# EAGLE board cape-c (EAGLE 6.6.0), part 1 of 2
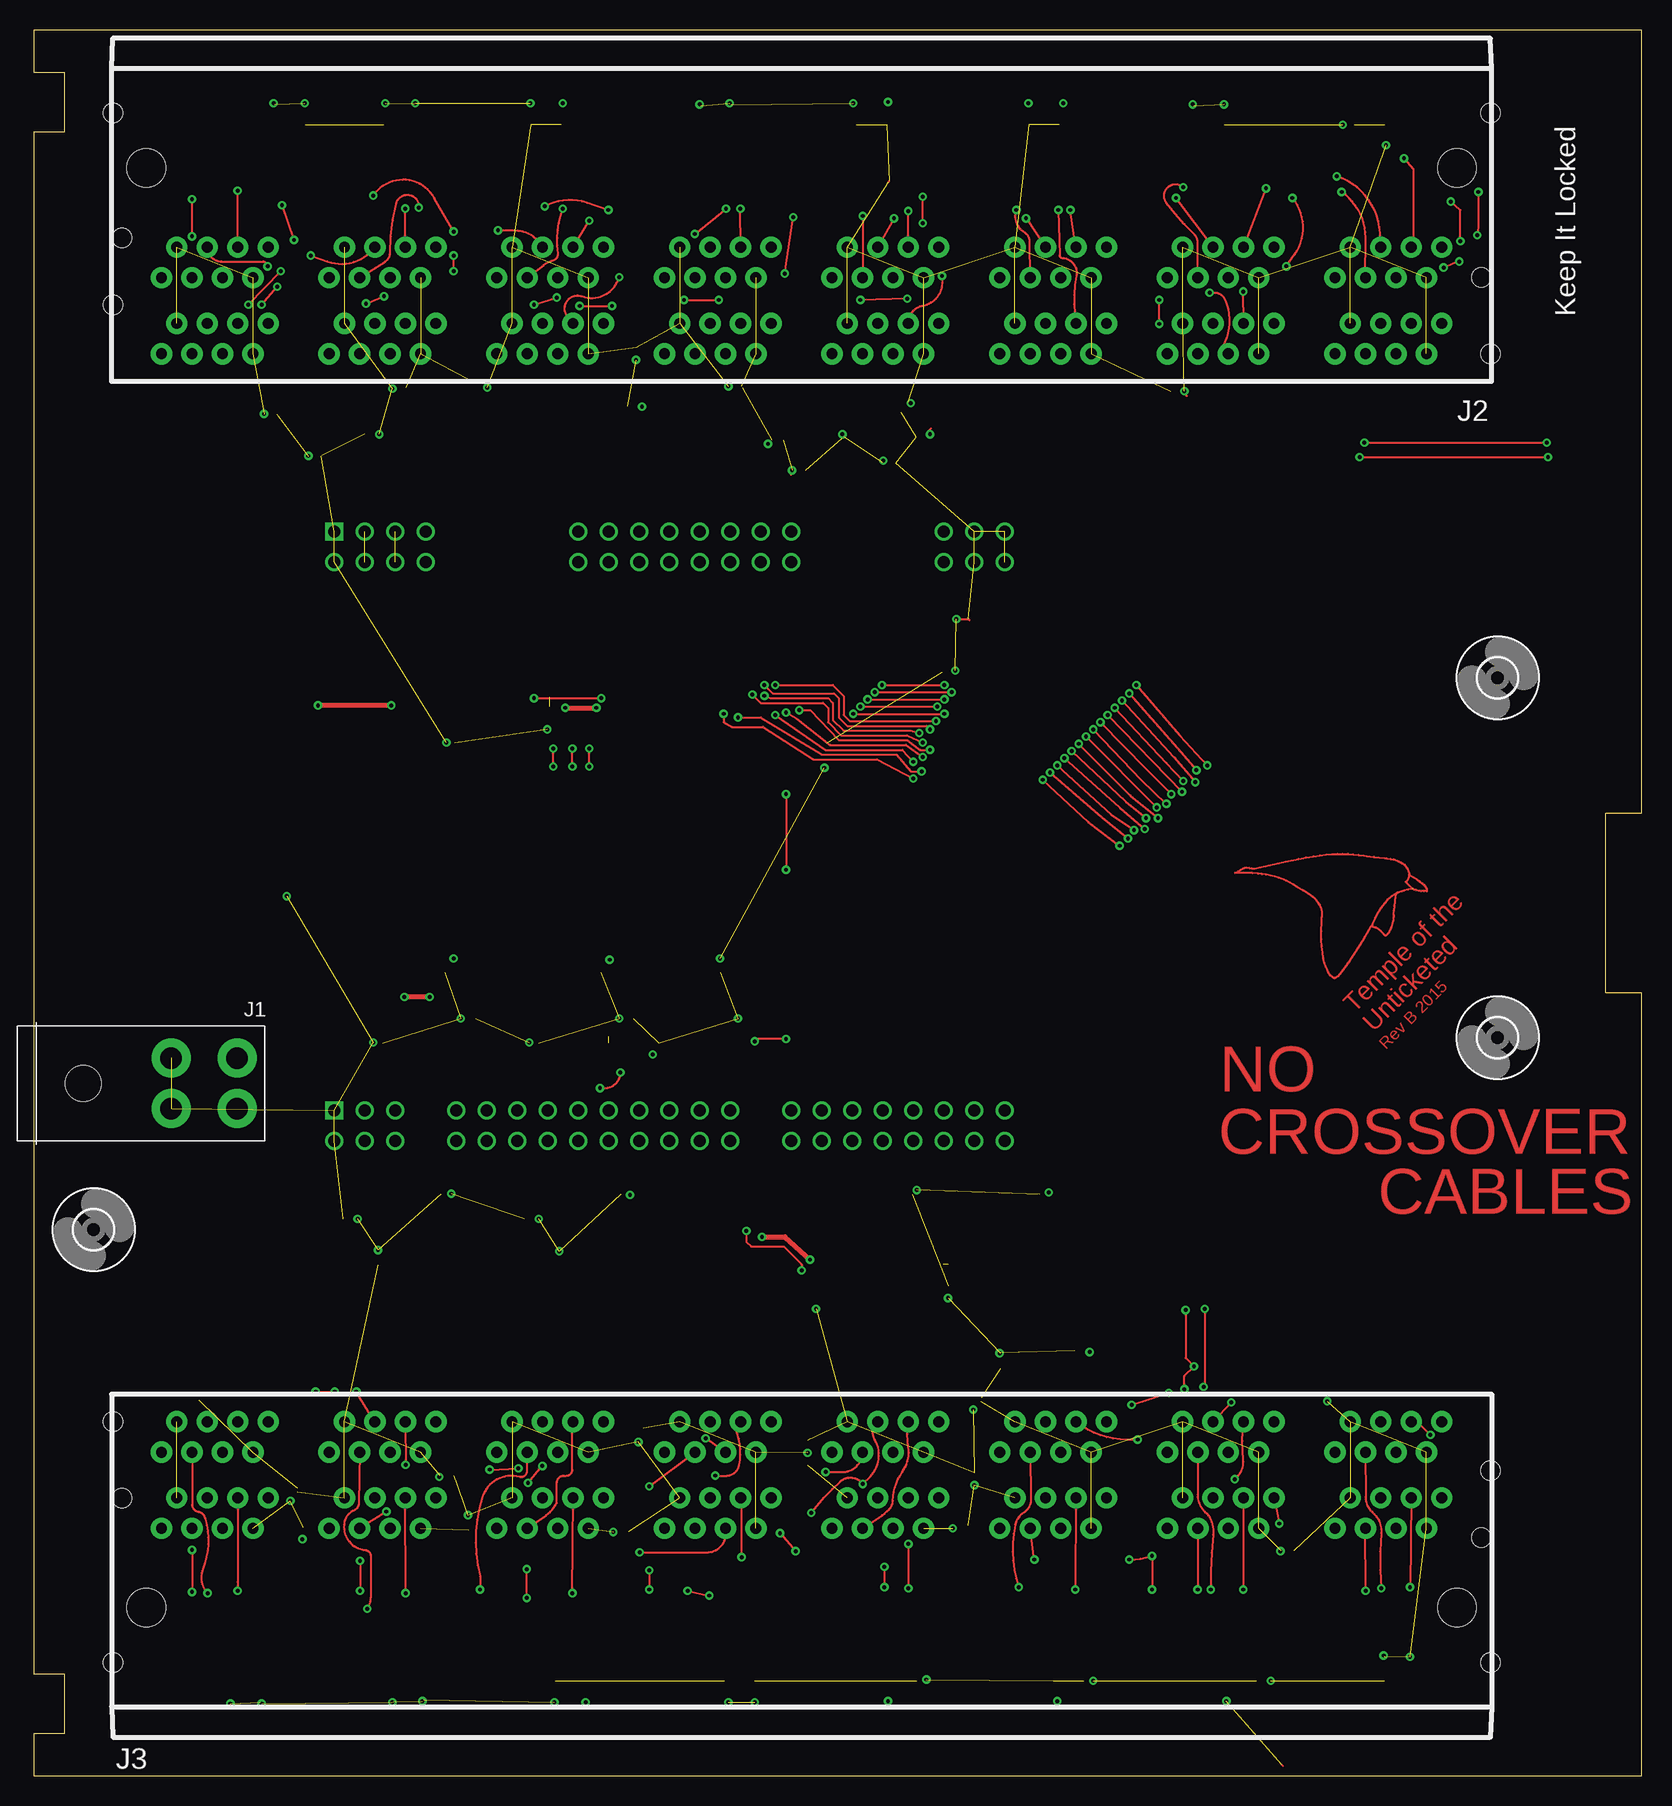
[diagram p2: board, top side]
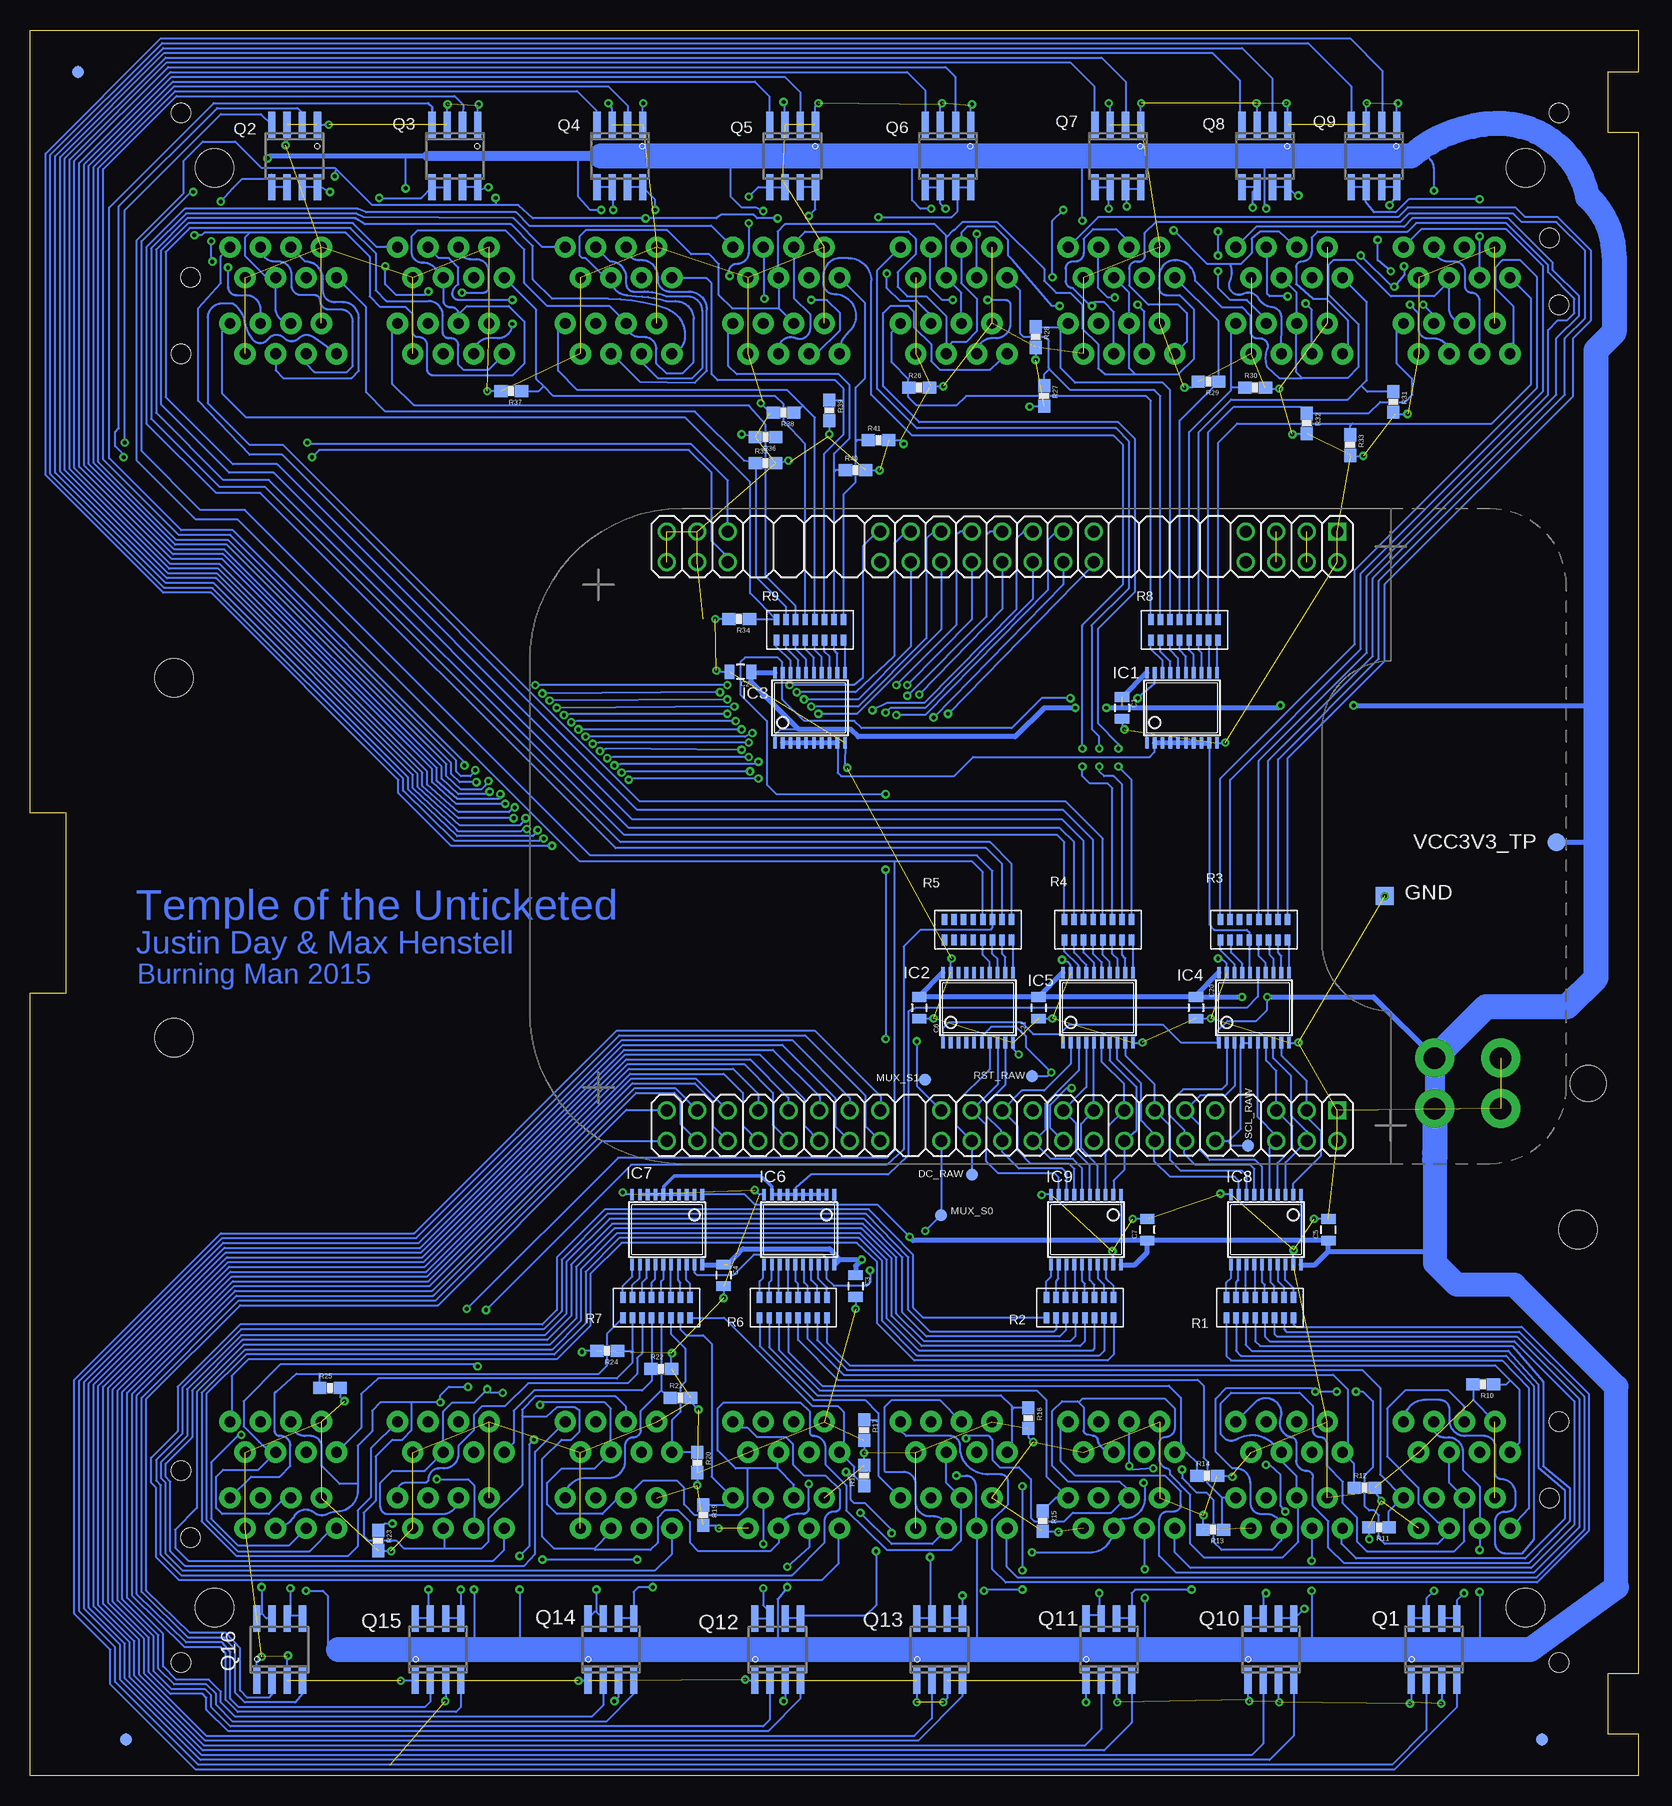
[diagram p3: board, bottom side, seen from below]

Size 134 x 145.5 mm. Coordinates in mm from the lower left corner, seen from the top.
Outline: 0,0 134,0 134,65.25 131,65.25 131,80.25 134,80.25 134,145.5 0,145.5 0,142 2.54,142 2.54,137 0,137 0,8.5 2.54,8.5 2.54,3.5 0,3.5 0,0
Copper layers (1*16): Top 0.0356mm / dielectric 1.5011mm / Bottom 0.0356mm
Design rules "LaenPCBOrder *": minimum track width 6mil, minimum drill 13mil, track to track 6mil, track to pad 6mil, pad to pad 6mil, via to via 6mil, smd to smd 6mil, copper to edge 15mil, drill to drill 6mil, minimum pad ring 7mil, minimum via ring 7mil, stop-mask expansion 3mil, vias tented up to drill 13mil, thermal gap 10mil

## Footprints (pad centres in the part's own frame; a part is rotated, then mirrored left to right if it is on the bottom)
0805 = smd 0.8 x 1.2: 1 -0.9,0; 2 0.9,0
TP10R = smd 1 x 1: TP 0,0
TP15SQ = smd 1.5 x 1.5: TP 0,0
TSSOP20 = smd 0.305 x 0.991: 1 -2.925,-2.918; 2 -2.275,-2.918; 3 -1.625,-2.918; 4 -0.975,-2.918; 5 -0.325,-2.918; 6 0.325,-2.918; 7 0.975,-2.918; 8 1.625,-2.918; 9 2.275,-2.918; 10 2.925,-2.918; 11 2.925,2.918; 12 2.275,2.918; 13 1.625,2.918; 14 0.975,2.918; 15 0.325,2.918; 16 -0.325,2.918; 17 -0.975,2.918; 18 -1.625,2.918; 19 -2.275,2.918; 20 -2.925,2.918
MOLEX-P4 = drill 1.8 pad 3.25: 1 2.1,-2.75; 2 -2.1,-2.75; 3 2.1,2.75; 4 -2.1,2.75 | hole 3: 0,-10.05
FCI-10118074-500A010LF = drill 0.9 pad 1.778: LA1 -53.34,6.6; LA2 -52.07,9.14; LA3 -50.8,6.6; LA4 -49.53,9.14; LA5 -48.26,6.6; LA6 -46.99,9.14; LA7 -45.72,6.6; LA8 -44.45,9.14; LB1 -39.37,6.6; LB2 -38.1,9.14; LB3 -36.83,6.6; LB4 -35.56,9.14; LB5 -34.29,6.6; LB6 -33.02,9.14; LB7 -31.75,6.6; LB8 -30.48,9.14; LC1 -25.4,6.6; LC2 -24.13,9.14; LC3 -22.86,6.6; LC4 -21.59,9.14; LC5 -20.32,6.6; LC6 -19.05,9.14; LC7 -17.78,6.6; LC8 -16.51,9.14; LD1 -11.43,6.6; LD2 -10.16,9.14; LD3 -8.89,6.6; LD4 -7.62,9.14; LD5 -6.35,6.6; LD6 -5.08,9.14; LD7 -3.81,6.6; LD8 -2.54,9.14; LE1 2.54,6.6; LE2 3.81,9.14; LE3 5.08,6.6; LE4 6.35,9.14; LE5 7.62,6.6; LE6 8.89,9.14; LE7 10.16,6.6; LE8 11.43,9.14; LF1 16.51,6.6; LF2 17.78,9.14; LF3 19.05,6.6; LF4 20.32,9.14; LF5 21.59,6.6; LF6 22.86,9.14; LF7 24.13,6.6; LF8 25.4,9.14; LG1 30.48,6.6; LG2 31.75,9.14; LG3 33.02,6.6; LG4 34.29,9.14; LG5 35.56,6.6; LG6 36.83,9.14; LG7 38.1,6.6; LG8 39.37,9.14; LH1 44.45,6.6; LH2 45.72,9.14; LH3 46.99,6.6; LH4 48.26,9.14; LH5 49.53,6.6; LH6 50.8,9.14; LH7 52.07,6.6; LH8 53.34,9.14; UA1 -44.45,15.49; UA2 -45.72,12.95; UA3 -46.99,15.49; UA4 -48.26,12.95; UA5 -49.53,15.49; UA6 -50.8,12.95; UA7 -52.07,15.49; UA8 -53.34,12.95; UB1 -30.48,15.49; UB2 -31.75,12.95; UB3 -33.02,15.49; UB4 -34.29,12.95; UB5 -35.56,15.49; UB6 -36.83,12.95; UB7 -38.1,15.49; UB8 -39.37,12.95; UC1 -16.51,15.49; UC2 -17.78,12.95; UC3 -19.05,15.49; UC4 -20.32,12.95; UC5 -21.59,15.49; UC6 -22.86,12.95; UC7 -24.13,15.49; UC8 -25.4,12.95; UD1 -2.54,15.49; UD2 -3.81,12.95; UD3 -5.08,15.49; UD4 -6.35,12.95; UD5 -7.62,15.49; UD6 -8.89,12.95; UD7 -10.16,15.49; UD8 -11.43,12.95; UE1 11.43,15.49; UE2 10.16,12.95; UE3 8.89,15.49; UE4 7.62,12.95; UE5 6.35,15.49; UE6 5.08,12.95; UE7 3.81,15.49; UE8 2.54,12.95; UF1 25.4,15.49; UF2 24.13,12.95; UF3 22.86,15.49; UF4 21.59,12.95; UF5 20.32,15.49; UF6 19.05,12.95; UF7 17.78,15.49; UF8 16.51,12.95; UG1 39.37,15.49; UG2 38.1,12.95; UG3 36.83,15.49; UG4 35.56,12.95; UG5 34.29,15.49; UG6 33.02,12.95; UG7 31.75,15.49; UG8 30.48,12.95; UH1 53.34,15.49; UH2 52.07,12.95; UH3 50.8,15.49; UH4 49.53,12.95; UH5 48.26,15.49; UH6 46.99,12.95; UH7 45.72,15.49; UH8 44.45,12.95 | hole 3.2: -54.61,0; 54.61,0 | hole 1.6: -57.4,-4.57; 57.4,-4.57; -56.64,9.14; 56.64,5.84; -57.4,15.49; 57.4,11.43
SO8 = smd 0.6 x 2.2: 1 -1.905,-2.6; 2 -0.635,-2.6; 3 0.635,-2.6; 4 1.905,-2.6; 5 1.905,2.6; 6 0.635,2.6; 7 -0.635,2.6; 8 -1.905,2.6
R0603-X8 = smd 0.45 x 0.9: 1A -2.8,0.85; 1B -2.8,-0.85; 2A -2,0.85; 2B -2,-0.85; 3A -1.2,0.85; 3B -1.2,-0.85; 4A -0.4,0.85; 4B -0.4,-0.85; 5A 0.4,0.85; 5B 0.4,-0.85; 6A 1.2,0.85; 6B 1.2,-0.85; 7A 2,0.85; 7B 2,-0.85; 8A 2.8,0.85; 8B 2.8,-0.85
0603-RES = smd 1.1 x 1: 1 -0.85,0; 2 0.85,0
BEAGLEBONE_SHIELD_NO_OUTLINE = drill 1 square: 1 4.445,19.05; 47 52.705,19.05 | drill 1: 2 1.905,19.05; 3 4.445,21.59; 4 1.905,21.59; 5 4.445,24.13; 6 1.905,24.13; 9 4.445,29.21; 10 1.905,29.21; 11 4.445,31.75; 12 1.905,31.75; 13 4.445,34.29; 14 1.905,34.29; 15 4.445,36.83; 16 1.905,36.83; 17 4.445,39.37; 18 1.905,39.37; 19 4.445,41.91; 20 1.905,41.91; 21 4.445,44.45; 22 1.905,44.45; 23 4.445,46.99; 24 1.905,46.99; 25 4.445,49.53; 26 1.905,49.53; 27 4.445,52.07; 28 1.905,52.07; 31 4.445,57.15; 32 1.905,57.15; 33 4.445,59.69; 34 1.905,59.69; 35 4.445,62.23; 36 1.905,62.23; 37 4.445,64.77; 38 1.905,64.77; 39 4.445,67.31; 40 1.905,67.31; 41 4.445,69.85; 42 1.905,69.85; 43 4.445,72.39; 44 1.905,72.39; 45 4.445,74.93; 46 1.905,74.93; 48 50.165,19.05; 49 52.705,21.59; 50 50.165,21.59; 51 52.705,24.13; 52 50.165,24.13; 53 52.705,26.67; 54 50.165,26.67; 63 52.705,39.37; 64 50.165,39.37; 65 52.705,41.91; 66 50.165,41.91; 67 52.705,44.45; 68 50.165,44.45; 69 52.705,46.99; 70 50.165,46.99; 71 52.705,49.53; 72 50.165,49.53; 73 52.705,52.07; 74 50.165,52.07; 75 52.705,54.61; 76 50.165,54.61; 77 52.705,57.15; 78 50.165,57.15; 87 52.705,69.85; 88 50.165,69.85; 89 52.705,72.39; 90 50.165,72.39; 91 52.705,74.93; 92 50.165,74.93
3,2 = hole 3.2: 0,0
FIDUCIAL_1MM = smd 1 x 1: 1 0,0
TP15R = smd 1.5 x 1.5: TP 0,0

## Placement (x,y rotation side)
C1  0.1uF  [0805]  43,89 270 bottom
C2  0.1uF  [0805]  74.8,92 180 bottom
C3  0.1uF  [0805]  65.2,40.8 270 bottom
C4  0.1uF  [0805]  76.2,41.7 270 bottom
C5  0.1uF  [0805]  25.8,45.5 90 bottom
C6  0.1uF  [0805]  59.9,64 270 bottom
C7  0.1uF  [0805]  40.9,45.5 90 bottom
C20  0.1uF  [0805]  36.85,64 270 bottom
C21  0.1uF  [0805]  49.95,64 270 bottom
DC_RAW  PTR1TP10R  [TP10R]  55.5,50.1 0 bottom
GND  PTR1TP15SQ  [TP15SQ]  21.1,73.3 0 bottom
IC1  74VHC541  [TSSOP20]  38,89 0 bottom
IC2  74VHC541  [TSSOP20]  55,64 0 bottom
IC3  74VHC541  [TSSOP20]  69,89 0 bottom
IC4  74VHC541  [TSSOP20]  32,64 0 bottom
IC5  74VHC541  [TSSOP20]  45,64 0 bottom
IC6  74VHC541  [TSSOP20]  69.9,45.5 180 bottom
IC7  74VHC541  [TSSOP20]  80.9,45.5 180 bottom
IC8  74VHC541  [TSSOP20]  31,45.5 180 bottom
IC9  74VHC541  [TSSOP20]  46,45.5 180 bottom
J1  MOLEX-P4  [MOLEX-P4]  14.2,57.7 270 top
J2  RJ45-8P8C-16FCI-16  [FCI-10118074-500A010LF]  64,134 180 top
J3  RJ45-8P8C-16FCI-16  [FCI-10118074-500A010LF]  64,14 0 top
MUX_S0  PTR1TP10R  [TP10R]  58.1,46.7 0 bottom
MUX_S1  PTR1TP10R  [TP10R]  59.4,58 0 bottom
Q1  N-MOSFET-DUALSO8  [SO8]  17,10.5 0 bottom
Q2  N-MOSFET-DUALSO8  [SO8]  111.95,135 180 bottom
Q3  N-MOSFET-DUALSO8  [SO8]  98.6,135 180 bottom
Q4  N-MOSFET-DUALSO8  [SO8]  84.85,135 180 bottom
Q5  N-MOSFET-DUALSO8  [SO8]  70.45,135 180 bottom
Q6  N-MOSFET-DUALSO8  [SO8]  57.5,135 180 bottom
Q7  N-MOSFET-DUALSO8  [SO8]  43.35,135 180 bottom
Q8  N-MOSFET-DUALSO8  [SO8]  31.1,135 180 bottom
Q9  N-MOSFET-DUALSO8  [SO8]  22,135 180 bottom
Q10  N-MOSFET-DUALSO8  [SO8]  30.6,10.5 0 bottom
Q11  N-MOSFET-DUALSO8  [SO8]  44.1,10.5 0 bottom
Q12  N-MOSFET-DUALSO8  [SO8]  71.7,10.5 0 bottom
Q13  N-MOSFET-DUALSO8  [SO8]  58.2,10.5 0 bottom
Q14  N-MOSFET-DUALSO8  [SO8]  85.6,10.5 0 bottom
Q15  N-MOSFET-DUALSO8  [SO8]  100,10.5 0 bottom
Q16  N-MOSFET-DUALSO8  [SO8]  113.2,10.5 0 bottom
R1  RESISTOR-X80603  [R0603-X8]  31.5,39 180 bottom
R2  RESISTOR-X80603  [R0603-X8]  46.5,39 180 bottom
R3  RESISTOR-X80603  [R0603-X8]  32,70.5 0 bottom
R4  RESISTOR-X80603  [R0603-X8]  45,70.5 0 bottom
R5  RESISTOR-X80603  [R0603-X8]  55,70.5 0 bottom
R6  RESISTOR-X80603  [R0603-X8]  70.4,39 180 bottom
R7  RESISTOR-X80603  [R0603-X8]  81.8,39 180 bottom
R8  RESISTOR-X80603  [R0603-X8]  37.8,95.5 0 bottom
R9  RESISTOR-X80603  [R0603-X8]  69,95.5 0 bottom
R10  [0603-RES]  12.9,32.6 180 bottom
R11  [0603-RES]  21.6,20.7 180 bottom
R12  [0603-RES]  22.8,24 0 bottom
R13  [0603-RES]  35.4,20.5 180 bottom
R14  [0603-RES]  35.9,25 0 bottom
R15  [0603-RES]  49.6,21.2 270 bottom
R16  [0603-RES]  50.8,29.8 270 bottom
R17  [0603-RES]  64.5,28.8 270 bottom
R18  [0603-RES]  64.5,25 90 bottom
R19  [0603-RES]  77.9,21.7 270 bottom
R20  [0603-RES]  78.4,26.1 270 bottom
R21  [0603-RES]  79.8,31.5 0 bottom
R22  [0603-RES]  81.4,33.9 0 bottom
R23  [0603-RES]  105,19.6 270 bottom
R24  [0603-RES]  85.9,35.4 180 bottom
R25  [0603-RES]  109,32.3 0 bottom
R26  [0603-RES]  59.9,115.7 0 bottom
R27  [0603-RES]  49.5,115 270 bottom
R28  [0603-RES]  50.2,119.9 270 bottom
R29  [0603-RES]  35.8,116.2 180 bottom
R30  [0603-RES]  31.9,115.7 0 bottom
R31  [0603-RES]  20.4,114.5 270 bottom
R32  [0603-RES]  27.6,112.7 270 bottom
R33  [0603-RES]  24,110.9 270 bottom
R34  [0603-RES]  74.9,96.4 180 bottom
R35  [0603-RES]  72.7,109.4 0 bottom
R36  [0603-RES]  72.71,111.56 180 bottom
R37  [0603-RES]  93.9,115.4 180 bottom
R38  [0603-RES]  71.2,113.6 180 bottom
R39  [0603-RES]  67.4,113.8 270 bottom
R40  [0603-RES]  65.2,108.8 0 bottom
R41  [0603-RES]  63.3,111.3 0 bottom
RST_RAW  PTR1TP10R  [TP10R]  50.5,58.3 0 bottom
SCL_RAW  PTR1TP10R  [TP10R]  32.5,52.5 0 bottom
U$1  BEAGLEBONE_NO_OUTLINE  [BEAGLEBONE_SHIELD_NO_OUTLINE]  6,51 90 bottom
U$2  [3,2]  5,45.5 0 top
U$3  [3,2]  122,91.5 0 top
U$4  FIDUCIAL  [FIDUCIAL_1MM]  126,3 0 bottom
U$5  FIDUCIAL  [FIDUCIAL_1MM]  8,3 0 bottom
U$6  FIDUCIAL  [FIDUCIAL_1MM]  130,142 0 bottom
U$12  [3,2]  122,61.5 0 top
VCC3V3_TP  PTR1TP15R  [TP15R]  6.8,77.8 180 bottom

## Tracks (layer width: path | path; a pad name or v marks a point on that pad's centre or on a via)
AD0
  Bottom 0.152: IC9.9 48.27,49.88 48.6,50.2 53.3,50.2 54.3,51.2 54.3,54.22 U$1.25 53.38,57.6 IC2.8
AD1
  Bottom 0.152: IC9.8 47.62,50.23 48,50.6 51.6,50.6 53,52 53,52.9 U$1.24 53.1,53.02 53.1,53.8 54.3,55 54.3,56 52.73,57.58 IC2.9
AD2
  Bottom 0.152: IC8.4 30.02,51.08 28.8,52.3 28.8,54.12 U$1.5 30.13,58.73 31,59.6 31,61.06 IC4.7
AD3
  Bottom 0.152: IC8.5 30.68,52.36 U$1.6 30.13,53.33 31.7,54.9 31.7,61.06 IC4.6
AD4
  Bottom 0.152: IC9.7 46.98,50.58 47.4,51 50.6,51 51.7,52.1 51.7,54.16 U$1.23 51.34,57.1 49.5,57.1 47.27,59.33 IC5.2
AD5
  Bottom 0.152: IC9.6 46.33,50.62 47.1,51.4 48.95,51.4 U$1.22 | IC5.3 46.62,58.77 49.4,56 49.4,53.8 50.3,52.91 U$1.22 | 50,53.3 50.05,53.3 U$1.22
AD6
  Bottom 0.152: IC8.2 28.73,49.38 26.4,51.7 26.4,53.7 27.59,54.89 U$1.3 27.59,57.89 29.7,60 29.7,61.06 IC4.9
AD7
  Bottom 0.152: IC8.3 29.38,51.12 U$1.4 27.59,53.69 28.9,55 28.9,58.3 30.4,59.8 30.4,61.06 IC4.8
AD8
  Bottom 0.152: IC9.5 45.67,50.88 46.8,52 46.8,54.34 U$1.19 45.98,57.38 IC5.4
AD9
  Bottom 0.152: IC8.8 32.62,50.02 33,50.4 38.1,50.4 39,51.3 39,54.16 U$1.13 40.29,57.59 42.7,60 42.7,61.06 IC5.9
AD10
  Bottom 0.152: IC8.9 33.27,49.58 33.6,49.9 39,49.9 40.3,51.2 40.3,52.9 U$1.14 40.29,53.39 41.4,54.6 41.4,57.7 43.4,59.7 43.4,61.06 IC5.8
AD11
  Bottom 0.152: IC9.4 45.02,50.83 46.4,52.3 46.4,54.31 U$1.17 45.37,61.04 IC5.5
AD12
  Bottom 0.152: IC8.7 31.98,50.58 32.3,50.9 36.9,50.9 37.8,51.8 37.8,52.85 U$1.12 37.8,52.95 37.8,53.8 39.1,55.1 39.1,56 37.9,57.2 34.7,57.2 34.27,57.62 IC4.2
AD13
  Bottom 0.152: IC8.6 31.32,50.73 31.9,51.3 35.7,51.3 36.5,52.1 36.5,54.2 U$1.11 36.49,56.7 34.4,56.7 33.62,57.48 IC4.3
AD14
  Bottom 0.152: IC9.2 43.7,48.44 43.7,49.6 42.83,50.47 U$1.16 41.8,53.73 41.8,57.4 44.02,59.62 IC5.7
AD15
  Bottom 0.152: IC9.3 44.38,51.92 44.1,52.2 44.1,54.17 U$1.15 42.83,57.63 44.7,59.5 44.7,61.06 IC5.6
BIRD1  (1 unrouted)
  Top 0.1: 113.99,73.7 114,73.7
  Top 0.152: 114.64,75.06 114.63,75.04 114.61,74.91 114.57,74.77 114.53,74.68 114.47,74.59 114.39,74.52 114.34,74.49 114.43,74.4 114.68,74.13 114.8,74.02 114.91,73.93 114.98,73.89 115.03,73.87 115.05,73.87 | 114.01,73.71 114,73.7 113.86,73.66 113.69,73.59 113.54,73.51 113.38,73.42 113.2,73.29 113.01,73.14 112.81,72.96 112.6,72.75 112.39,72.49 112.19,72.2 111.98,71.87 111.79,71.49 111.6,71.07 111.52,70.83 | 100.11,75.23 100.16,75.25 100.39,75.37 100.61,75.5 100.73,75.58 100.8,75.62 100.91,75.67 101.02,75.69 101.13,75.69 101.3,75.66 101.49,75.62 101.65,75.6 101.73,75.59 102.68,75.81 104.34,76.18 105.41,76.4 106.05,76.52 106.64,76.62 107.19,76.7 107.7,76.76 108.19,76.8 108.65,76.82 109.09,76.83 109.53,76.81 109.96,76.78 110.4,76.74 110.86,76.68 111.09,76.64 111.69,76.57 112.61,76.46 112.76,76.45 113.06,76.41 113.31,76.36 113.47,76.31 113.63,76.26 113.78,76.2 113.93,76.12 114.07,76.03 114.2,75.92 114.32,75.8 114.43,75.67 114.51,75.51 114.58,75.33 114.63,75.14 114.65,75.03 114.71,75 115,74.86 115.26,74.71 115.53,74.53 115.73,74.37 115.85,74.26 115.95,74.14 116.03,74.03 116.08,73.91 116.11,73.81 116.11,73.75 116.11,73.72 116.08,73.72 115.87,73.71 115.62,73.72 115.42,73.75 115.21,73.8 115,73.87 114.89,73.92 114.84,73.91 114.55,73.85 114.22,73.77 113.99,73.7 113.78,73.62 113.64,73.55 113.56,73.51 113.53,73.48 113.49,73.27 113.37,72.5 113.33,72.09 113.32,71.87 113.32,71.78 113.33,71.71 113.33,71.57 113.31,71.42 113.29,71.26 113.23,71.02 113.12,70.7 113.03,70.48 112.97,70.35 112.9,70.24 112.83,70.15 112.77,70.08 112.71,70.03 112.65,70.01 112.61,70.02 112.59,70.04 112.58,70.05 112.51,70.14 112.38,70.28 112.26,70.4 112.15,70.49 112.05,70.56 111.95,70.62 111.84,70.67 111.71,70.71 111.62,70.74 111.58,70.77 111.57,70.8 111.56,70.84 111.56,70.91 111.56,70.94 111.44,70.75 110.93,69.91 110.44,69.12 109.89,68.28 109.49,67.69 109.24,67.33 109,67.02 108.8,66.76 108.66,66.62 108.59,66.55 108.52,66.5 108.47,66.48 108.45,66.48 108.43,66.47 108.38,66.48 108.3,66.51 108.22,66.57 108.12,66.66 108.01,66.78 107.9,66.95 107.78,67.17 107.68,67.44 107.58,67.76 107.48,68.14 107.41,68.59 107.35,69.11 107.32,69.7 107.31,70.38 107.34,71.14 107.36,71.55 107.37,71.62 107.38,71.75 107.38,71.87 107.37,72 107.34,72.17 107.28,72.38 107.19,72.58 107.07,72.76 106.94,72.92 106.78,73.08 106.62,73.22 106.44,73.36 106.14,73.55 105.74,73.79 105.33,74.03 105.13,74.16 104.99,74.26 104.69,74.44 104.38,74.6 104.05,74.74 103.72,74.85 103.39,74.95 103.05,75.03 102.72,75.09 102.38,75.14 102.05,75.18 101.56,75.21 100.94,75.23 100.37,75.23 100.11,75.23
  pour Top (no thermals): 111.48,76.55 111.48,76.5 111.51,76.23 111.54,75.97 111.59,75.66 111.67,75.34 111.75,75.09 111.81,74.93 111.88,74.78 111.96,74.65 112.01,74.58 112.06,74.51 112.14,74.35 112.2,74.17 112.25,73.98 112.28,73.79 112.3,73.6 112.31,73.4 112.31,73.21 112.29,72.93 112.26,72.61 112.2,72.29 112.19,72.22 112.74,72.9 112.86,73 112.78,73.32 112.78,73.56 112.77,73.83 112.74,74.12 112.7,74.33 112.66,74.46 112.61,74.58 112.55,74.69 112.52,74.74 112.48,74.8 112.4,74.93 112.33,75.06 112.27,75.21 112.2,75.43 112.14,75.71 112.11,75.98 112.09,76.21 112.09,76.44 112.09,76.49
  pour Top: 105.57,73.89 105.69,73.84 106.19,73.58 106.53,73.39 106.78,73.23 107.02,73.06 107.26,72.86 107.49,72.66 107.7,72.43 107.84,72.26 107.92,72.13 107.99,72.01 108.05,71.88 108.1,71.75 108.14,71.61 108.16,71.47 108.17,71.33 108.17,71.26 108.05,70.26 107.94,69.11 107.91,68.65 107.91,68.38 107.91,68.13 107.93,67.9 107.97,67.69 108.02,67.48 108.09,67.28 108.17,67.08 108.28,66.87 108.4,66.66 108.47,66.55 108.39,66.6 108.25,66.73 108.12,66.88 107.99,67.06 107.87,67.27 107.77,67.51 107.67,67.78 107.58,68.09 107.51,68.43 107.44,68.81 107.39,69.23 107.36,69.68 107.33,70.18 107.33,70.72 107.33,71.3 107.36,71.92 107.38,72.25 107.38,72.29 107.37,72.36 107.36,72.43 107.33,72.5 107.28,72.6 107.18,72.74 107.05,72.88 106.91,73.02 106.75,73.15 106.58,73.28 106.32,73.46 106,73.65 105.65,73.84
  pour Top: 114.88,74.05 114.92,74.04 115.1,74 115.24,74 115.35,74 115.41,74.02 115.46,74.05 115.49,74.09 115.5,74.15 115.49,74.22 115.46,74.31 115.39,74.42 115.34,74.48 115.3,74.54 115.24,74.63 115.23,74.67 115.23,74.68 115.25,74.69 115.3,74.67 115.37,74.63 115.51,74.52 115.73,74.33 115.89,74.18 115.98,74.07 116.05,73.97 116.1,73.89 116.12,73.83 116.12,73.8 116.12,73.78 116.1,73.76 116.09,73.75 116.06,73.74 115.99,73.72 115.85,73.71 115.64,73.72 115.42,73.75 115.21,73.8 115.03,73.87 114.93,73.92 114.89,73.96 114.86,73.99 114.87,74.03
  pour Top: 114.2,75.93 114.2,75.88 114.19,75.77 114.17,75.66 114.12,75.56 114.07,75.48 114.01,75.44 113.97,75.42 113.93,75.4 113.88,75.4 113.82,75.4 113.77,75.42 113.74,75.43 113.73,75.44 113.66,75.47 113.6,75.49 113.52,75.5 113.43,75.5 113.33,75.48 113.22,75.44 113.17,75.4 112.72,75.44 113.06,75.19 113.07,75.17 113.07,75.15 113.1,75.06 113.14,74.98 113.2,74.9 113.26,74.85 113.32,74.82 113.38,74.8 113.45,74.79 113.53,74.79 113.63,74.8 113.68,74.81 114.04,74.78 114.03,74.8 113.99,74.91 113.97,75.04 113.97,75.12 113.98,75.18 114,75.21 114.03,75.24 114.06,75.27 114.09,75.28 114.1,75.28 114.22,75.33 114.33,75.39 114.4,75.44 114.45,75.5 114.47,75.55 114.47,75.58 114.47,75.6
BL-0-1  (via drill 0.33)
  Top 0.152: J2.LA6 111,128.2 arc56 v109,132
  Bottom 0.152: v109,132 109.94,132.5 Q2.8 Q2.7
BL-0-2  (via drill 0.33)
  Top 0.152: v117.5,125.7 118.4,126.1 v118.8,126.2 | v118.9,127.9 118.9,130.5 v118.1,131.2
  Bottom 0.152: v117.5,125.7 117.5,124.1 arc-90 116.8,123.4 116,123.4 arc90 114.8,122.2 J2.UA6 | v118.8,126.2 118.9,126.3 v118.9,127.9 | 113.9,133.4 113.86,133.44 113.86,132.9 | 113.86,132.9 Q2.5 Q2.6 | v118.1,131.2 117.1,132.3 116.3,133.1 114.06,133.1 113.86,132.9
BL-1-1  (via drill 0.33)
  Top 0.152: J2.LB6 97,127.8 arc46 96.7,128.5 arc-9 94.4,131.1 arc-168 v95.8,132.4
  Bottom 0.152: v95.8,132.4 96.69,132.1 Q3.8 Q3.7
BL-1-2  (via drill 0.33)
  Top 0.152: v104.4,125.8 105.1,126.8 arc75 v104.9,131.5 | J2.UB6 v100.8,123.7
  Bottom 0.152: v100.8,123.7 101.1,123.4 103.5,123.4 104.4,124.3 v104.4,125.8 | v104.9,131.5 101.41,131.5 Q3.5 Q3.6
BL-2-1  (via drill 0.33)
  Top 0.152: v44.9,15.2 J3.LC6
  Bottom 0.152: v44.9,15.2 44.9,13.7 45,13.6 45,13.37 | 45,13.37 Q11.7 | 45,13.37 45.74,13.37 Q11.8
BL-2-2  (via drill 0.33)
  Top 0.152: v37.2,15.5 37.2,16.6 arc-32 37.4,23.2 arc-87 40.5,24.9 arc103 41.1,25.3 J3.UC6
  Bottom 0.152: v37.2,15.5 41.9,15.5 42.2,15.2 Q11.5 Q11.6
BL-3-1  (via drill 0.33)
  Top 0.152: v51.3,17.1 v51.3,15.5 | v51.3,24.1 J3.UD6 | v54.5,15.4 v56.3,15
  Bottom 0.152: v51.3,24.1 v51.3,17.1 | v51.3,15.5 54.1,15.5 v54.5,15.4 | v56.3,15 Q13.5 Q13.6
BL-3-2  (via drill 0.33)
  Top 0.152: v59,18.2 59,23.06 J3.LD6
  Bottom 0.152: v59,18.2 59,13.27 Q13.7 Q13.8
BL-4-1  (via drill 0.33)
  Top 0.152: J2.LC6 83,127.9 arc58 82.6,128.6 arc-77 v81.9,130.5
  Bottom 0.152: v81.9,130.5 81.9,131.35 Q4.8 Q4.7
BL-4-2  (via drill 0.33)
  Top 0.152: v85.4,130.5 85.5,126.7 arc87 85.7,126.5 arc-100 86.9,125 arc21 J2.UC6
  Bottom 0.152: v85.4,130.5 85.4,132.31 Q4.6 Q4.5
BL-5-1  (via drill 0.33)
  Top 0.152: v69.1,130 J2.LD6
  Bottom 0.152: v69.1,130 68.55,130.56 Q5.8 Q5.7
BL-5-2  (via drill 0.33)
  Top 0.152: v74.1,129.4 v74.1,131.6 | v75.7,125 75.7,124.4 arc-80 74.1,122.5 arc81 J2.UD6
  Bottom 0.152: v74.1,131.6 73.3,132.4 Q5.5 Q5.6 | v74.1,129.4 74.1,127 arc90 75.1,126 arc-118 v75.7,125
BL-6-1  (via drill 0.33)
  Top 0.152: J3.LA6 17,16.13 v17,15.4
  Bottom 0.152: v17,15.4 17.64,14.77 Q1.7 Q1.8
BL-6-2  (via drill 0.33)
  Top 0.152: J3.UA6 13.2,22.6 arc80 13.7,22 arc-69 14.3,21.4 arc-37 14.1,17.2 arc65 v14.5,15.2
  Bottom 0.152: v14.5,15.2 15.1,14.61 Q1.5 Q1.6
BL-7-1  (via drill 0.33)
  Top 0.152: v31,15.2 J3.LB6
  Bottom 0.152: v31,15.2 31.23,14.96 Q10.7 Q10.8
BL-7-2  (via drill 0.33)
  Top 0.152: J3.UB6 27.1,22.7 arc-65 26.7,22.1 arc56 25.9,21.1 arc95 27.6,18.8 arc-90 28.1,18.3 28.1,15 arc-31 v27.8,13.9
  Bottom 0.152: v27.8,13.9 28.6,13.1 Q10.5 Q10.6
BL-8-1  (via drill 0.33)
  Top 0.152: v62.6,125.2 v63.3,129.9
  Bottom 0.152: J2.UE6 59.1,121.23 59.1,121.9 60.1,122.9 61.5,122.9 62.6,124 v62.6,125.2 | v63.3,129.9 57.2,129.9 56.7,130.4 56.7,131.9 56.87,132.06 Q6.7 Q6.8
BL-8-2  (via drill 0.33)
  Top 0.152: v55.1,128.5 v57.7,130.6
  Bottom 0.152: J2.LE6 v55.1,128.5 | v57.7,130.6 58.13,131.03 Q6.6 Q6.5
BL-9-1  (via drill 0.33)
  Top 0.152: 98.3,15.7 v98.1,15.5 arc-8 98.3,20.1 arc53 97.6,22 arc-47 97,23.4 J3.UG6
  Bottom 0.152: v98.1,15.5 Q15.5 Q15.6
BL-9-2  (via drill 0.33)
  Top 0.152: J3.LG6 100.8,23.11 v100.8,15.5
  Bottom 0.152: v100.8,15.5 100.8,12.6 100.7,12.5 100.7,13.04 Q15.7 Q15.8
BL-10-1  (via drill 0.33)
  Top 0.152: J3.UH6 111,23.2 arc49 111.6,21.9 arc-54 112.3,20.2 arc9 v112.3,15.6
  Bottom 0.152: v112.3,15.6 112.3,13.37 | 112.3,13.37 Q16.6 | 112.3,13.37 111.56,13.37 Q16.5
BL-10-2  (via drill 0.33)
  Top 0.152: J3.LH6 v114.7,15.7
  Bottom 0.152: v114.7,15.7 114.7,13.51 | 114.7,13.51 Q16.8 | Q16.7 114.3,13.1 114.7,13.51
BL-11-1  (via drill 0.33)
  Top 0.152: v47.9,130.5 46.1,131.1 arc47 v42.6,130.8 | J2.UF6 44.5,121.6 arc-149 45.7,123.3 arc94 v48.8,124.9
  Bottom 0.152: v48.8,124.9 48.8,129.6 v47.9,130.5 | v42.6,130.8 42.6,132.28 | 42.6,132.28 Q7.7 | 42.6,132.28 41.56,132.28 Q7.8
BL-11-2  (via drill 0.33)
  Top 0.152: J2.LF6 42.5,125.9 arc-22 43.3,126.3 arc81 43.7,126.9 arc-26 v44.1,130.6
  Bottom 0.152: v44.1,130.6 44.1,132.28 Q7.6 Q7.5
BL-12-1  (via drill 0.33)
  Top 0.152: J3.UF6 83.1,23 arc-59 82.5,21.9 arc46 81.8,20.9 arc31 v82.1,15.7
  Bottom 0.152: v82.1,15.7 83.3,15.7 83.7,15.3 Q14.5 Q14.6
BL-12-2  (via drill 0.33)
  Top 0.152: J3.LF6 v86.8,15.5
  Bottom 0.152: v86.8,15.5 86.8,13.66 | 86.8,13.66 Q14.7 | 86.8,13.66 86.94,13.66 Q14.8
BL-13-1  (via drill 0.33)
  Top 0.152: v62.2,20.2 v63.5,18.7 | v66,25.3 67.4,25.3 arc89 J3.UE6
  Bottom 0.152: v63.5,18.7 63.5,14.2 64.4,13.3 69.59,13.3 Q12.5 Q12.6 | v62.2,20.2 62.2,20.5 64.4,22.7 65.3,22.7 65.6,23 65.6,24.5 v66,25.3
BL-13-2  (via drill 0.33)
  Top 0.152: v72.9,19.3 v72.9,15.6
  Bottom 0.152: J3.LE6 v72.89,19.31 v72.9,19.3 | v72.9,15.6 72.9,14.2 72.4,13.7 72.5,13.7 72.5,13.27 Q12.7 Q12.8
BL-14-1  (via drill 0.33)
  Top 0.152: v35,125.4 v35,126.7 | v35,128.7 33.4,131.5 arc116 v28.3,131.7
  Bottom 0.152: J2.UG6 31.38,121.78 32.6,123 34,123 35,124 v35,125.4 | v35,126.7 v35,128.7 | v28.3,131.7 28.5,131.71 Q8.8 Q8.7
BL-14-2  (via drill 0.33)
  Top 0.152: J2.LG6 29.3,126.2 arc56 29.7,126.9 arc-11 30.2,131 arc-173 v32.1,130.7
  Bottom 0.152: v32.1,130.7 32.1,132.03 Q8.6 Q8.5
BL-15-1  (via drill 0.33)
  Top 0.152: v17.9,122.6 v20.6,125.4 | v21.7,128 v20.7,130.9
  Bottom 0.152: J2.UH6 17.01,121.71 v17.9,122.6 | v20.6,125.4 21.7,126.3 v21.7,128 | v20.7,130.9 20.1,131.69 Q9.8 Q9.7
BL-15-2  (via drill 0.33)
  Top 0.152: v13.2,128.3 v13.2,131.4
  Bottom 0.152: J2.LH6 v13.2,128.3 | v13.2,131.4 19.1,131.4 20.2,130.3 22,130.3 22.7,131.2 22.7,132.34 Q9.6 Q9.5
BUF0_A
  Bottom 0.152: R5.7A 53,76 54.3,77.3 85.2,77.3 114.8,106.9 118.5,106.9 124.3,112.7 124.3,127.4 121.1,130.6 106.7,130.6 106,130.3 93.5,130.3 92.4,129.2 77.23,129.2 J2.LD1
BUF0_B
  Bottom 0.152: R2.8A 59.55,38.15 60.4,39 60.4,43.4 64.1,47.2 86.1,47.2 90.1,43.2 90.1,38.8 91.3,37.6 116.5,37.6 121.7,32.4 121.7,28.7 123.9,26.5 123.9,24.4 123.5,24 123.5,18.2 121.6,16.3 68,16.3 66.6,17.7 66.6,20.54 J3.LE1
BUF1_A
  Bottom 0.152: R5.8A 52.2,76 54,77.8 84.8,77.8 114.4,107.4 118.2,107.4 123.9,113.1 123.9,127.3 121,130.2 106.8,130.2 106.2,129.9 93.7,129.8 91.3,127.4 J2.LC1
BUF1_B
  Bottom 0.152: R2.7A 48.5,37.2 48.7,37 59,37 60.8,38.8 60.8,43.2 64.3,46.8 85.9,46.8 89.7,43 89.7,38.7 91.2,37.2 116.4,37.2 121.3,32.3 121.3,28.5 123.5,26.3 123.5,24.6 123.1,24.2 123.1,18.4 121.4,16.7 70.5,16.7 67.8,19.4 67.8,21.2 arc90 67,22 66.9,22 arc-90 66.5,22.4 66.5,23.8 67.7,25 69.5,25 70.4,25.9 70.4,27.6 71,28.2 73.4,28.2 74.2,29 74.94,29 J3.UE1
BUF2_A
  Bottom 0.152: R3.6A 30.8,84.6 22.1,93.3 22.1,99.8 6.8,115.1 6.8,119.8 4.9,121.7 4.9,123.3 7.1,125.5 7.1,126.1 10.8,129.8 18.8,129.8 19.5,129.1 31.82,129.1 J2.LG1
BUF2_B
  Bottom 0.152: R1.3A 30.3,36.8 30.1,36.6 10.1,36.6 4.9,31.4 4.9,20.7 8.7,16.9 38.5,16.9 39.9,18.3 39.9,21.3 arc90 39.2,22 38.7,22 arc-90 38.1,22.6 38.1,23.7 39.4,25 46.9,25 48.1,26.2 48.1,28.88 J3.UC1
BUF3_A
  Bottom 0.152: R3.5A 31.6,84.6 22.6,93.6 22.6,100 7.5,115.1 7.5,120.5 6.7,121.3 5.9,121.3 5.3,121.9 5.3,123.1 7.5,125.3 7.5,125.9 11,129.4 18.5,129.4 19.2,128.7 26.7,128.7 27.2,128.2 27.2,127 arc90 28,126.2 arc-90 28.5,125.7 28.5,124.3 27.1,123.1 26,123.1 24.2,121.3 24.2,118.94 J2.UG1
BUF3_B
  Bottom 0.152: R1.4A 31.1,36.6 30.7,36.2 10.3,36.2 5.3,31.2 5.3,20.9 8.9,17.3 37.3,17.3 38.6,18.6 J3.LC1
BUF4_A
  Bottom 0.152: R4.1A 47.8,77.8 48.4,78.4 84.5,78.4 114.1,108 117.9,108 123.5,113.6 123.5,127.2 120.9,129.8 106.9,129.8 106.1,129.3 93.9,129.3 92.1,127.5 92.1,124.7 90.5,123.1 85.8,123.1 arc19 81,122.3 arc85 79.5,119.52 arc61 J2.UC1
BUF4_B
  Bottom 0.152: R2.6A 47.7,37.1 48.2,36.6 59.3,36.6 61.3,38.6 61.3,43.2 64.5,46.4 85.7,46.4 89.3,42.8 89.3,38.5 91.1,36.7 116.4,36.7 120.9,32.2 120.9,28.3 123.1,26.1 123.1,24.8 122.7,24.4 122.7,18.5 121.3,17.1 81.9,17.1 80.5,18.5 J3.LF1
BUF5_A
  Bottom 0.152: R4.2A 47,77.8 48.2,79 84.1,79 113.7,108.6 117.4,108.6 123.1,114.3 123.1,127.1 120.8,129.4 107.1,129.4 105.1,127.4 J2.LB1
BUF5_B
  Bottom 0.152: R2.5A 46.9,36.6 47.3,36.2 59.5,36.2 61.8,38.5 61.8,43.2 64.6,46 85.5,46 88.9,42.6 88.9,38.3 90.9,36.3 116.3,36.3 120.5,32.1 120.5,28.2 122.7,26 122.7,24.9 122.3,24.5 122.3,18.7 121.1,17.5 92.8,17.5 91.9,18.5 91.9,26.99 J3.UF1
BUF6_A
  Bottom 0.152: R3.8A 29.2,84.8 21.1,92.9 21.1,99.3 5.4,115 5.4,119.8 3.9,121.3 3.9,127.1 6.7,129.9 9.4,129.9 10.2,130.7 19.2,130.7 20,129.9 44.99,129.9 J2.LF1
BUF6_B
  Bottom 0.152: R1.1A 28.7,37.6 28.5,37.4 9.7,37.4 4.1,31.8 4.1,20.4 8.4,16.1 52.7,16.1 53.8,17.2 53.8,21.3 52.5,22.6 52.5,24.5 arc-90 53.1,25.1 54.2,25.1 arc90 56.5,27.4 56.5,27.5 arc-90 57.3,28.3 61,28.3 61.46,28.76 J3.UD1
BUF7_A
  Bottom 0.152: R3.7A 30,84.7 21.6,93.1 21.6,99.6 6.1,115.1 6.1,119.8 4.4,121.5 4.4,127.1 6.8,129.5 9.7,129.5 10.4,130.2 19.1,130.2 19.8,129.5 40.2,129.5 41.1,128.6 41.1,126.7 arc109 41.8,126.2 arc-90 42.4,125.6 42.4,124.2 40.8,122.6 38.3,122.6 37.6,121.9 37.6,119.51 J2.UF1
BUF7_B
  Bottom 0.152: R1.2A 29.5,37.2 29.3,37 9.9,37 4.5,31.6 4.5,20.5 8.5,16.5 51.7,16.5 52.6,17.4 52.6,20.57 J3.LD1
BUF8_A
  Bottom 0.152: R4.3A 46.2,77.9 48,79.7 83.8,79.7 113.4,109.3 117.1,109.3 122.7,114.9 122.7,127 120.7,129 107.3,129 105.2,126.9 105.2,123.8 104.3,122.9 100.8,122.9 arc90 99.6,121.7 99.6,120.3 arc-90 99.1,119.8 98.9,119.8 arc90 98.3,119.2 98.3,117.6 97.9,117.2 95.79,117.2 J2.UB1
BUF8_B
  Bottom 0.152: R2.4A 46.1,36.2 46.5,35.8 59.7,35.8 62.2,38.3 62.2,43.1 64.7,45.6 85.3,45.6 88.5,42.4 88.5,38.1 90.7,35.9 116.2,35.9 120.1,32 120.1,22.3 121.9,20.5 121.9,19 120.8,17.9 95.4,17.9 94.5,18.8 94.5,20.58 J3.LG1
BUF9_A  (via drill 0.33)
  Top 0.152: v43.3,84.1 v43.3,85.6
  Bottom 0.152: R4.8A 42.2,83 v43.3,84.1 | J2.UE1 53.98,117.2 58.2,117.2 58.9,117.9 58.9,119.3 60.3,120.7 60.3,122 60.8,122.5 62.3,122.5 62.9,121.9 62.9,115.8 59.9,112.8 43.3,112.8 41.9,111.4 41.9,98.7 45,95.6 45,87.7 43.3,86 v43.3,85.6
BUF9_B
  Bottom 0.152: R1.7A 33.5,35.4 33.1,35 11,35 8.7,32.5 8.7,19.7 9.7,18.5 11,18.5 arc90 11.9,19.4 11.9,21.2 arc90 11.1,22 10.9,22 arc-90 10.2,22.7 10.2,23.5 arc-90 11.4,24.7 arc90 11.9,25.2 11.9,27.4 arc-90 12.8,28.3 14.4,28.3 arc90 15.7,29.6 15.7,30.5 arc-90 16.5,31.3 17.74,31.3 arc-90 J3.UA1
BUF10_A  (via drill 0.33)
  Top 0.152: v44.9,84.1 v44.9,85.6
  Bottom 0.152: R4.7A 43,82.6 43.7,83.3 44.5,83.3 44.9,83.7 v44.9,84.1 | J2.LE1 63.4,125.46 63.4,115.6 60.1,112.3 43.5,112.3 42.4,111.2 42.4,99 45.55,95.85 45.5,95.8 45.5,87.2 44.9,86.6 v44.9,85.6
BUF10_B
  Bottom 0.152: R1.8A 34.3,35 33.9,34.6 11.3,34.6 9.1,32.3 9.1,22.26 J3.LA1
BUF11_A
  Bottom 0.152: R4.4A 45.4,78 47.9,80.5 83.4,80.5 113,110.1 115.7,110.1 120,114.6 120,122.3 118.1,124.4 118.1,126.64 J2.LA1
BUF11_B
  Bottom 0.152: R2.3A 45.3,35.6 45.5,35.4 59.9,35.4 62.6,38.1 62.6,43 64.8,45.2 85.1,45.2 88.1,42.2 88.1,37.9 90.5,35.5 116.1,35.5 119.7,31.9 119.7,21.2 116.8,18.3 107.5,18.3 106.7,19.1 106.7,22.1 105.6,23.2 105.6,27.26 J3.UG1
BUF12_A
  Bottom 0.152: R3.1A 34.8,83.1 23.6,94.3 23.6,100.5 8.4,115.7 8.4,124.9 9.8,126.3 11.3,126.3 11.9,125.7 11.9,124 10.4,122.5 10.4,118.77 J2.UH1
BUF12_B
  Bottom 0.152: R1.6A 32.7,35.9 32.2,35.4 10.8,35.4 8.3,32.6 8.3,25.7 6.1,23.8 6.1,21.4 9.4,18.1 23.5,18.1 24.7,19.3 24.7,20.53 J3.LB1
BUF13_A
  Bottom 0.152: R3.2A 34,83 23.1,93.9 23.1,100.2 7.9,115.4 7.9,125.8 11,128.9 18.05,128.9 J2.LH1
BUF13_B
  Bottom 0.152: R1.5A 31.9,36.2 31.5,35.8 10.5,35.8 7.9,32.8 7.9,25.8 5.7,24 5.7,21.2 9.1,17.7 24.5,17.7 25.8,19 25.8,21.2 27.1,22.5 27.1,24.8 arc-100 27.6,25.4 arc90 28.5,26.3 28.5,27.8 arc-90 28.9,28.2 arc95 29.8,29.8 arc-153 31.91,31.1 J3.UB1
BUF14_A  (via drill 0.33)
  Top 0.152: v46.3,84.1 v46.3,85.6
  Bottom 0.152: R4.6A 43.8,82.3 44.2,82.7 45.7,82.7 46.3,83.3 v46.3,84.1 | v46.3,85.6 46.3,95.8 46.35,95.85 42.9,99.3 42.9,110.9 43.7,111.7 60.5,111.7 63.9,115.1 63.9,124.6 arc-90 65.8,126.5 66.4,126.5 arc-90 67.9,125 67.9,124.4 arc-90 67,123.5 arc139 65.8,120.3 arc-53 J2.UD1
BUF14_B
  Bottom 0.152: R2.1A 43.7,35.1 44.2,34.6 60.3,34.6 63.4,37.7 63.4,42.8 65.1,44.4 84.7,44.4 87.3,41.8 87.3,37.5 90.1,34.7 115.8,34.7 117.2,33.3 117.2,29.63 J3.UH1
BUF15_A
  Bottom 0.152: R4.5A 44.6,78.1 47.7,81.2 83.2,81.2 112.9,110.9 115.7,110.9 119.2,114.4 119.2,121.5 arc90 118,122.7 117.1,122.7 arc48 116.1,121.2 arc-27 115.5,119.8 arc-117 114.2,119.7 arc100 112.8,119.8 arc-90 111.6,119.8 arc80 110.4,119.9 J2.UA1
BUF15_B
  Bottom 0.152: R2.2A 44.5,35.4 44.9,35 60.1,35 63,37.9 63,42.9 64.9,44.8 84.9,44.8 87.7,42 87.7,37.7 90.3,35.1 116,35.1 119.3,31.8 119.3,21.3 116.7,18.7 110.7,18.7 108.8,20.6 J3.LH1
DC  (via drill 0.33)
  Top 0.152: v91.5,30.9 v94.6,31.9 | v120.4,132 120.4,129.1 v120.3,128.4 | v96,38.8 96,34.8 v96.7,34.1 95.9,33.3 v95.9,32.2 | J3.UD4 v56,28.1
  Bottom 0.152: v96,38.8 83.9,50.9 62.6,50.9 61.2,52.2 61.2,69.1 59.8,70.5 54,70.5 53.8,70.7 R5.6A 53.8,75.4 55.1,76.7 87.3,76.7 116.1,105.5 119.8,105.5 124.7,110.4 124.7,127.9 120.6,132 v120.4,132 | v91.5,30.9 91.5,31.1 86.1,31.1 85.59,30.59 J3.UF4 86.94,25.6 89.7,25.6 90.9,24.4 90.9,22.6 90.1,21.8 86.3,21.8 84.96,23.14 J3.LF4 84.32,23.18 82.9,24.6 80.1,24.6 79.5,24 79.5,22.6 78.6,21.7 74.9,21.7 74.2,22.4 74.2,25.6 | v94.6,31.9 95.6,31.9 v95.9,32.2 97,31.1 98.8,31.1 99.56,30.34 J3.UG4 101.11,25.4 103.8,25.4 104.8,24.4 104.8,22.4 arc-90 104.2,21.8 99.63,21.8 arc-90 J3.LG4 98.9,23.14 | J3.LH4 112.76,23.14 114.1,21.8 118,21.8 118.5,22.3 118.5,24.9 117.9,25.5 114.98,25.5 J3.UH4 arc26 114.9,27.8 116.2,29.1 116.2,31.2 113.1,34.3 96.8,34.3 v96.7,34.1 | J3.LE4 70.35,24.25 71.7,25.6 | 71.7,25.6 74.2,25.6 | 74.2,25.6 75.2,25.6 76.7,27.1 76.7,30.6 76.2,31.1 69.8,31.1 69,30.3 69,28.6 arc-90 68.7,28.3 arc90 67.7,27.3 67.7,25.9 66,24.2 66,22.1 62.6,18.8 57.2,18.8 56.4,19.6 56.4,23.12 J3.LD4 57.65,24.41 J3.UD4 57.65,26.75 | 42.66,23.14 43.9,21.9 47.1,21.9 47.8,21.2 50.3,21.2 50.6,21.5 50.6,24.7 51.6,25.7 53.2,25.7 53.8,26.3 53.8,28 54.1,28.3 55.9,28.3 v56,28.1 | 42.66,23.14 J3.LC4 | 42.66,23.14 42.66,23.96 43.2,24.5 47.5,24.5 48.8,25.8 48.8,30.4 48,31.2 46.7,31.2 46.6,31.1 | 46.6,31.1 46.2,30.7 46.2,28.8 arc-90 45.8,28.4 45.4,28.3 arc90 45,27.9 arc-77 J3.UC4 43.35,26.95 | 71.7,25.6 71.7,26.87 J3.UE4 | J3.UA4 15.74,24.41 J3.LA4 14.47,19.53 15.3,18.7 22.6,18.7 23.4,19.5 23.4,21.5 24.6,22.7 24.6,24.5 25.9,25.8 25.9,27.6 arc-90 26.5,28.2 arc90 27.1,28.8 27.1,30.8 28.2,31.9 33.9,31.9 34.8,31 34.8,28.5 34.3,28 arc-61 33.5,28 arc75 30.36,27.6 J3.UB4 29.7,26.2 28.44,24.94 J3.LB4 28.3,23 28.3,19.5 29.6,18.2 36.2,18.2 37.3,19.3 37.3,23.4 39,25.1 39,25.4 39.2,25.6 arc82 39.9,26.4 39.9,27.7 arc90 39.4,28.2 arc-90 38.6,29 38.6,30.6 39.4,31.4 46.3,31.4 46.6,31.1
  Bottom 0.152: 71.62,122.32 J2.LD4 71.7,124.94 71.7,128.7 71.1,129.3 58.6,129.3 57.65,128.35 57.65,128.2 | 71.62,122.32 J2.UD4 | J2.LC4 85.04,124.86 | J2.UC4 84.32,121.12 85.7,122.5 90.9,122.5 92.8,124.4 92.8,127.2 94.4,128.8 101.7,128.8 102.2,128.3 102.2,127 arc-90 101.3,126.1 101.2,126.1 arc90 99.96,124.86 J2.LB4 99.56,122.96 arc-90 99,122.4 98.88,122.4 arc90 98.29,121.81 | J2.UB4 98.29,121.81 | 98.29,121.81 97.6,122.5 94.1,122.5 92.8,121.2 92.8,117.7 93.8,116.7 100.4,116.7 arc90 100.9,117.2 100.9,119.2 arc-90 101.6,119.9 101.7,119.9 arc90 102.1,120.3 102.1,121.8 102.7,122.4 104.8,122.4 105.7,123.3 105.7,126.6 107.7,128.6 115.7,128.6 | 57.65,128.2 J2.LE4 56.38,123.59 J2.UE4 | 57.65,128.2 57.05,128.8 57,128.8 56.3,129.5 53.4,129.5 49.5,125.6 49.5,124.6 48.5,123.6 47.3,123.6 46.3,122.6 46.3,120.6 45,119.3 45,117.3 44.4,116.8 41.9,116.8 | J2.LF4 42.41,123.59 J2.UF4 42.4,117.3 41.9,116.8 | J2.LG4 28.44,123.59 J2.UG4 28.5,120.99 28.5,117 28,116.5 | 28,116.5 24.2,116.5 23.3,117.4 23.3,121 25.8,123.5 25.8,125.9 25.4,126.3 23.6,126.3 20.6,123.3 17,123.3 15.74,124.56 J2.LH4 15.74,122.32 arc-90 J2.UH4 | 71.62,122.32 71.64,122.3 75.5,122.3 76.6,123.4 76.6,126 77.4,126.8 78.9,126.8 80.9,128.8 87.7,128.8 88.2,128.3 88.2,126.7 88,126.5 87.7,126.5 86.06,124.86 J2.LC4 | 83.65,121.05 J2.UC4 | 28,116.5 29.9,116.5 30.9,117.4 arc46 30.9,118.9 arc-122 31.6,119.8 arc99 32.3,120.4 32.3,121.7 33,122.4 34.7,122.4 36.9,124.6 36.9,124.7 arc-90 38.5,126.3 38.6,126.3 arc-90 39.9,125 39.9,124 arc-90 39.3,123.4 38.2,123.4 37,122.2 37,118.1 38.3,116.8 41.9,116.8
  Bottom 0.152: 115.7,128.6 116.1,128.2 116.1,126.7 114.26,124.86 J2.LA4 113.53,122.32 arc-90 J2.UA4 | 115.7,128.6 119.5,128.6 119.7,128.4 v120.3,128.4 | J2.LC4 arc-90 84.23,123.4 83.5,123.3 arc18 81,122.9 80.2,122.9 arc90 78.7,121.4 78.7,117.8 79.6,116.9 81,116.9 81.8,117.7 81.8,118.9 arc-90 82.8,119.9 83.17,119.9 arc90 J2.UC4
DC_RAW
  Bottom 0.152: IC2.7 54.02,58.88 56.8,56.1 56.8,54.17 U$1.26 55.5,52.88 DC_RAW.TP
GND  (via drill 0.33)  (161 unrouted)
  Top 0.152: 71.2,132.8 71.3,132.9 | 104,0.9 104.1,0.8 | v61.2,111 61.2,110.8 61.1,110.7 | v63.2,108.8 63.2,108.5 63.1,108.4 | v67.4,111.8 67.4,111.5 67.5,111.6 | v73.1,114.4 73,114.4 72.9,114.5 | v74.7,111.8 74.6,112.1 74.8,112.3 | v70.8,109.6 70.7,109.5 | v95.9,115.4 95.9,115.2 96.1,115 | v76.9,96.4 77.9,96.4 78,96.3
  Bottom 0.152: Q9.1 20.09,139.31 v20,139.4 | Q9.3 22.64,139.37 v22.6,139.4 | Q8.1 29.2,139.29 v29.3,139.4 | Q8.3 31.73,139.34 v31.8,139.4 | Q7.1 41.45,139.35 v41.4,139.4 | Q7.3 43.98,139.28 v44.1,139.4 | Q6.1 55.59,139.21 v55.5,139.3 | Q6.3 58.13,139.26 v58,139.4 | Q5.1 68.55,139.16 v68.3,139.4 | Q5.3 71.08,139.38 v71.2,139.5 | Q4.1 82.94,139.35 v82.9,139.4 | Q4.3 85.48,138.99 v85.8,139.4 | Q3.1 96.69,139.21 v96.6,139.3 | Q3.3 99.23,139.26 v99.2,139.3 | Q2.1 v109.1,137.6 | Q2.3 112.58,136.01 v112.7,135.9 | Q16.1 115.11,9.49 v114.7,9.9 | Q16.3 112.56,9.94 v112.5,10 | Q15.1 v103.1,7.9 | Q15.3 99.36,6.33 v99.4,6.2 | Q14.1 v88.3,7.9 | Q14.3 84.97,6.54 v85.3,6.2 | Q12.1 74.3,7.9 v74.4,8 | Q12.3 71.06,6.33 v71.2,6.2 | Q13.1 60.1,6.3 v60.1,6.1 | Q13.3 57.56,6.43 v57.9,6.1 | Q11.1 v46.01,6.11 v46,6.1 | Q11.3 43.47,6.17 v43.4,6.1 | Q10.1 32.51,6.3 v32.4,6.2 | Q10.3 29.96,6.17 v29.9,6.1 | Q1.1 18.91,6.09 v19,6 | Q1.3 16.36,6.04 v16.4,6 | R10.2 13.75,31.31 J3.UA7 | R12.2 21.95,23.65 v21.4,22.9 | R11.2 22.45,19.75 v22.4,19.7 | R14.2 33.9,25 v33.8,24.9 | R13.2 36.25,21.35 v36.2,21.7 | R16.2 50.8,28.2 v50.4,27.8 | R15.2 48.35,20.35 v48.3,20.3 | R18.2 v64.5,26.9 R17.2 | R19.2 76.85,20.85 v76.6,20.6 | R20.2 v78.4,24.2 | R21.2 78.95,31.15 v78.3,30.5 | R22.2 80.55,35.25 v80.5,35.2 | R24.2 87.9,35.4 v88,35.3 | R23.2 103.95,18.75 v103.9,18.7 | R25.2 108.15,31.55 v107.8,31.2 | C3.2 v65.2,38.9 | C4.2 v76.2,39.8 | IC6.10 73.22,48.42 v73.6,48.8 | IC7.10 84.42,48.42 v84.6,48.6 | C2.2 76.7,92 v76.8,92.1 | IC3.10 66.09,84.2 v65.9,84 | R26.2 58.95,115.8 v57.9,115.8 | R28.2 v50.2,118 | R27.2 49.55,114.1 v50.7,114.1 | R29.2 37.15,115.7 v37.8,115.7 | R30.2 30.95,115.6 v29.9,115.6 | R32.2 27.65,111.8 v28.8,111.8
  Bottom 0.152: R33.2 23.95,110 v22.9,110 | R31.2 20.25,113.5 v19.2,113.5 | IC1.10 34.42,86.08 v34.4,86.1 | C1.2 43,87.4 v42.8,87.2 | IC8.10 34.52,48.42 v34.8,48.5 | IC8.19 28.73,43.52 v28.7,43.8 | C5.2 v27,46.4 | C7.2 v42.1,46.4 | IC9.19 43.73,43.62 v43.8,43.7 | IC9.10 49.68,48.42 v49.7,48.4 | IC4.19 34.27,67.67 34.5,67.9 v35,68.1 | C20.2 v35.6,63.1 | IC4.10 28.42,61.08 v28.3,61.1 | IC5.10 41.52,61.08 v41.3,61.1 | IC5.19 47.27,67.58 47.5,67.8 47.8,67.9 v48,68 | IC2.10 52.08,60.58 v51.6,60.1 | IC2.19 57.27,68.03 v57.2,68.1 | C6.2 v58.7,63.1 | C21.2 v48.8,63.1 | R41.2 61.5,111.3 v61.2,111 | R40.2 v63.2,108.8 | R39.2 v67.4,111.8 | R38.2 72.3,113.6 v73.1,114.4 | R36.2 74.56,111.76 v74.7,111.8 | R35.2 v70.8,109.6 | R37.2 v95.9,115.4 | R34.2 v76.9,96.4
  Bottom 0.406: 21.1,73.5 GND.TP
  other vias: 21.1,73.3
  cutout Top (isolate 0.305): 0.3,145 0.2,0.3 133.6,0.3 133.7,145
MUX_S0  (via drill 0.33)
  Top 0.152: v59.4,45.4 59.4,44.5 59.8,44.1 62.5,44.1 64,42.6 v64,42.1
  Bottom 0.152: U$1.28 58.07,46.73 | 58.07,46.73 v59.4,45.4 | v64,42.1 64,41.1 64.3,40.8 67,40.8 67.6,41.4 67.6,42.56 IC6.19 67.62,43.12 67.9,43.4 73.7,43.4 75.4,41.7 78.4,41.7 78.6,41.9 78.6,42.56 IC7.19 | MUX_S0.TP 58.04,46.7 58.07,46.73
MUX_S1  (via drill 0.33)
  Top 0.152: v41.7,89.8 v47.3,89.8 | v62.7,81.8 v62.7,75.5 | v62.7,61.4 60.3,61.4 v60.1,61.2
  Bottom 0.152: v41.7,89.8 40.27,91.03 IC1.19 | v47.3,89.8 49.7,89.8 52.2,87.3 64.7,87.3 65.3,87.9 69.5,87.9 71.3,89.7 71.3,91.89 | 71.3,91.89 71.3,92.8 71.7,93.2 74.4,93.2 74.8,92.8 74.8,90.1 72.6,87.9 72.6,82.6 71.8,81.8 v62.7,81.8 | 71.3,91.89 IC3.19 | v62.7,75.5 v62.7,61.4 | v60.1,61.2 60.1,58 | 60.1,58 60.1,57.48 U$1.27 | MUX_S1.TP 60.1,58
N$5
  Bottom 0.152: IC2.14 54.02,67.83 54.6,68.4 R5.5B
N$6
  Bottom 0.152: IC2.13 53.38,68.08 53.8,68.5 R5.6B
N$7
  Bottom 0.152: R1.1B 28.7,40.6 29.4,41.3 29.4,42.56 IC8.18
N$8
  Bottom 0.152: R1.2B 29.5,40.7 30,41.2 30,42.56 IC8.17
N$9
  Bottom 0.152: R1.3B 30.3,40.8 30.6,41.1 30.6,42.51 IC8.16
N$10
  Bottom 0.152: R1.4B 31.1,40.9 31.3,41.1 31.3,42.56 IC8.15
N$11
  Bottom 0.152: R1.5B 31.9,42.51 IC8.14
N$12
  Bottom 0.152: R1.6B 32.7,42.51 IC8.13
N$13
  Bottom 0.152: R1.7B 33.5,41.1 33.3,41.3 33.3,42.56 IC8.12
N$14
  Bottom 0.152: R1.8B 34.3,41.1 33.9,41.5 33.9,42.56 IC8.11
N$15
  Bottom 0.152: R2.1B 43.7,40.8 44.3,41.4 44.3,42.51 IC9.18
N$16
  Bottom 0.152: R2.2B 44.5,40.9 45,41.4 45,42.56 IC9.17
N$17
  Bottom 0.152: R2.3B 45.3,40.9 45.7,41.3 45.7,42.56 IC9.16
N$18
  Bottom 0.152: R2.4B 46.1,41 46.3,41.2 46.3,42.56 IC9.15
N$19
  Bottom 0.152: R2.5B 46.9,42.51 IC9.14
N$20
  Bottom 0.152: R2.6B 47.7,42.51 IC9.13
N$21
  Bottom 0.152: R2.7B 48.5,41.2 48.3,41.4 48.3,42.56 IC9.12
N$22
  Bottom 0.152: R2.8B 49.3,41.2 48.9,41.6 48.9,42.56 IC9.11
N$23
  Bottom 0.152: IC5.18 46.62,67.53 47.8,68.7 R4.1B
N$24
  Bottom 0.152: IC5.17 45.98,67.58 47,68.6 R4.2B
N$25
  Bottom 0.152: IC5.16 45.33,67.72 46.2,68.6 R4.3B
N$26
  Bottom 0.152: IC5.15 44.67,67.78 45.4,68.5 R4.4B
N$27
  Bottom 0.152: IC5.13 43.38,68.08 43.8,68.5 R4.6B
N$28
  Bottom 0.152: IC5.14 44.02,67.83 44.6,68.4 R4.5B
N$29
  Bottom 0.152: IC5.12 42.73,68.12 43,68.4 R4.7B
N$30
  Bottom 0.152: IC5.11 42.08,69.53 R4.8B
N$31
  Bottom 0.152: IC4.18 33.62,67.62 34.8,68.8 R3.1B
N$32
  Bottom 0.152: IC4.17 32.98,67.67 33.9,68.6 33.9,69.55 R3.2B
N$33
  Bottom 0.152: R6.1B 67.6,40.7 68.3,41.4 68.3,42.56 IC6.18
N$34
  Bottom 0.152: IC2.12 52.73,68.22 53,68.5 R5.7B
N$35
  Bottom 0.152: IC4.14 31.02,67.72 31.6,68.3 R3.5B
N$36
  Bottom 0.152: IC4.13 30.38,68.08 30.7,68.4 30.7,69.55 R3.6B
N$37
  Bottom 0.152: IC4.12 29.73,68.33 30,68.6 R3.7B
N$38
  Bottom 0.152: IC4.11 29.07,69.53 R3.8B
N$39
  Bottom 0.152: IC2.11 52.08,69.53 R5.8B
N$40
  Bottom 0.152: R6.2B 68.4,40.8 68.9,41.3 68.9,42.56 IC6.17
N$41
  Bottom 0.152: R6.3B 69.2,40.8 69.5,41.1 69.5,42.51 IC6.16
N$42
  Bottom 0.152: R6.4B 70,41 70.2,41.2 70.2,42.56 IC6.15
N$43
  Bottom 0.152: R6.5B 70.8,42.51 IC6.14
N$44
  Bottom 0.152: R6.6B 71.6,42.51 IC6.13
N$45
  Bottom 0.152: R6.7B 72.4,41.1 72.2,41.3 72.2,42.56 IC6.12
N$46
  Bottom 0.152: R6.8B 73.2,41.2 72.9,41.5 72.9,42.51 IC6.11
N$47
  Bottom 0.152: R7.1B 79,41 79.3,41.3 79.3,42.56 IC7.18
N$48
  Bottom 0.152: R7.2B 79.8,41.1 80,41.3 80,42.51 IC7.17
N$49
  Bottom 0.152: R7.4B 81.4,41.2 81.2,41.4 81.2,42.56 IC7.15
N$50
  Bottom 0.152: R7.3B 80.6,42.56 IC7.16
N$51
  Bottom 0.152: R7.5B 82.2,41.1 81.9,41.4 81.9,42.56 IC7.14
N$52
  Bottom 0.152: R7.7B 83.8,40.9 83.2,41.5 83.2,42.56 IC7.12
N$53
  Bottom 0.152: R7.6B 83,41.1 82.6,41.5 82.6,42.51 IC7.13
N$54
  Bottom 0.152: R7.8B 84.6,40.8 83.8,41.6 83.8,42.56 IC7.11
N$55
  Bottom 0.152: IC1.18 39.62,92.92 40.6,93.9 R8.1B
N$56
  Bottom 0.152: IC1.17 38.98,92.88 39.8,93.7 R8.2B
N$57
  Bottom 0.152: IC1.16 38.33,93.12 39,93.8 R8.3B
N$58
  Bottom 0.152: IC1.15 37.67,93.28 38.2,93.8 R8.4B
N$59
  Bottom 0.152: IC1.14 37.02,93.42 37.4,93.8 R8.5B
N$60
  Bottom 0.152: IC1.13 36.38,93.58 36.6,93.8 R8.6B
N$61
  Bottom 0.152: IC1.12 35.73,94.58 R8.7B
N$62
  Bottom 0.152: IC1.11 35.08,94.58 R8.8B
N$63
  Bottom 0.152: IC3.18 70.62,92.92 71.8,94.1 R9.1B
N$64
  Bottom 0.152: IC3.17 69.97,92.97 71,94 R9.2B
N$65
  Bottom 0.152: IC3.16 69.33,93.03 70.2,93.9 R9.3B
N$66
  Bottom 0.152: IC3.15 68.67,93.17 69.4,93.9 R9.4B
N$67
  Bottom 0.152: IC3.14 68.03,93.22 68.6,93.8 R9.5B
N$68
  Bottom 0.152: IC3.13 67.38,93.28 67.8,93.7 R9.6B
N$69
  Bottom 0.152: IC3.12 66.72,93.53 67,93.8 R9.7B
N$70
  Bottom 0.152: IC3.11 66.08,94.53 R9.8B
PWM0  (via drill 0.33)
  Top 0.152: v110.5,109.9 v126.2,109.9
  Bottom 0.152: U$1.88 75.85,101.55 77.2,102.9 77.2,108.6 79.1,110.5 109.9,110.5 v110.5,109.9 | v126.2,109.9 126.2,110.1 126.9,110.8 126.9,112 126.6,112.3 126.6,130.8 118.4,139 111.7,139 111.3,138.6 111.3,137.62 Q2.2
PWM1  (via drill 0.33)
  Top 0.152: v110.9,111.1 v126.1,111.1
  Bottom 0.152: U$1.87 75.85,107.95 78.9,111 110.8,111 v110.9,111.1 | v126.1,111.1 126.1,130.5 118.1,138.5 114.75,138.5 Q2.4
PWM2  (via drill 0.33)
  Top 0.152: v70.1,90.3 v76.5,90.3 | v91.3,90.2 95.6,85.3 v96.9,83.8
  Bottom 0.152: U$1.75 60.99,103.7 62,102.7 62,93.3 65.2,90.3 v70.1,90.3 | v96.9,83.8 96.9,83.7 97.3,83.3 98.1,83.3 98.5,83.7 98.5,84.6 117.3,103.4 121.6,103.4 127.9,109.7 127.9,133.9 121.8,140 98.62,140 97.91,139.28 Q3.2 | v76.5,90.3 v91.3,90.2
PWM3  (via drill 0.33)
  Top 0.152: v70.7,90.9 v75.9,90.9 | v91.9,90.9 95.5,86.7 v97.8,84.2
  Bottom 0.152: U$1.77 63.4,103.7 64.6,102.5 64.6,91.5 65.3,90.9 v70.7,90.9 | v97.8,84.2 97.8,84.5 117.1,103.8 121.4,103.8 127.4,109.8 127.4,130.7 118.7,139.4 100.81,139.4 100.5,139.09 | 100.5,137.9 100.5,139.09 | 100.5,139.09 Q3.4 | v75.9,90.9 v91.9,90.9
PWM4  (via drill 0.33)
  Top 0.152: v68.9,89.1 v75.3,89.1 | v90.1,89 94.4,84.4 v95.8,82.9
  Bottom 0.152: U$1.73 58.7,103.7 59.3,103.1 59.3,94.8 65,89.1 v68.9,89.1 | v95.8,82.9 96.1,82.5 96.4,82.2 98.1,82.2 99.3,83.3 99.3,84.3 117.6,102.6 121.9,102.6 128.7,109.4 128.7,134.1 122,140.8 85.8,140.8 84.2,139.2 84.2,137.62 Q4.2 | v75.3,89.1 v90.1,89
PWM5  (via drill 0.33)
  Top 0.152: v69.5,89.7 v75.9,89.7 | v90.7,89.6 95,84.9 v96.8,82.8
  Bottom 0.152: U$1.76 60.61,94.09 65,89.7 v69.5,89.7 | v96.8,82.8 98.2,82.8 98.9,83.5 98.9,84.4 117.5,103 121.8,103 128.3,109.5 128.3,134 121.9,140.4 88.4,140.4 86.8,138.8 86.8,137.65 Q4.4 | v75.9,89.7 v90.7,89.6
PWM6  (via drill 0.33)
  Top 0.152: v61.8,90.9 66.6,90.9 67.5,90 67.5,88.4 68,87.9 v75.2,87.9 | v88.9,87.8 92.7,83.9 v94.8,81.8
  Bottom 0.152: U$1.71 56.49,103.7 56.8,103.4 56.8,95.9 v61.8,90.9 | v75.2,87.9 88.4,87.9 v88.9,87.8 | v94.8,81.8 94.7,81.7 94.9,81.4 98.4,81.4 100.1,82.9 100.1,84 117.9,101.8 122.1,101.8 129.5,109.2 129.5,134.3 122.2,141.6 71.1,141.6 69.8,140.3 69.8,137.62 Q5.2
PWM7  (via drill 0.33)
  Top 0.152: v68.3,88.5 v75.9,88.5 | v89.5,88.4 v95.7,82
  Bottom 0.152: U$1.74 58.07,95.53 65.1,88.5 v68.3,88.5 | v75.9,88.5 89,88.5 v89.5,88.4 | v95.7,82 95.9,81.8 98.3,81.8 99.7,83.1 99.7,84.1 117.8,102.2 122,102.2 129.1,109.3 129.1,134.2 122.1,141.2 73.6,141.2 72.4,140 72.4,137.65 Q5.4
PWM8  (via drill 0.33)
  Top 0.152: v60.9,90 61.4,89.8 66.2,89.8 66.6,89.4 66.6,88 67.5,87.1 73.1,87.1 v73.8,86.9 | v87.7,86.6 v93.6,80.7
  Bottom 0.152: U$1.69 53.99,103.7 54.3,103.4 54.3,96.6 v60.9,90 | v73.8,86.9 74.4,86.6 v87.7,86.6 | v93.6,80.7 94.1,80.3 98.3,80.3 100.9,82.6 100.9,83.7 118.2,101 122.3,101 130.3,109 130.3,134.6 122.5,142.4 57.7,142.4 56.9,141.6 56.9,137.63 Q6.2
PWM9  (via drill 0.33)
  Top 0.152: v60.9,90.9 61.6,90.2 66.7,90.2 67.1,89.8 67.1,88.2 67.8,87.5 74.4,87.5 v74.7,87.2 | v88.3,87.2 92.3,83 v94.4,81
  Bottom 0.152: U$1.72 55.53,96.37 v60.9,90.9 | v74.7,87.2 v88.3,87.2 | v94.4,81 98.5,81 100.5,82.8 100.5,83.9 118,101.4 122.2,101.4 129.9,109.1 129.9,134.4 122.3,142 60.9,142 59.4,140.5 Q6.4
PWM10  (via drill 0.33)
  Top 0.152: v63.8,88.8 64.7,88.8 67.1,86.3 72.8,86.3 73.9,85.5 v74.7,85.5 | v86.5,85.4 91,81.2 v92.7,79.8
  Bottom 0.152: U$1.67 51.2,103.7 51.8,103.1 51.8,97.2 59.5,89.4 62.6,89.4 v63.8,88.8 | v74.7,85.5 86,85.6 v86.5,85.4 | v92.7,79.8 93.2,79.2 98.2,79.2 101.7,82.4 101.7,83.5 118.4,100.2 122.5,100.2 131.1,108.8 131.1,134.8 122.7,143.2 44.7,143.2 42.7,141.2 42.7,137.62 Q7.2
PWM11  (via drill 0.33)
  Top 0.152: v59.9,90.1 60.6,89.4 65.8,89.4 66.2,89 66.2,87.8 67.3,86.7 72.8,86.7 v74.1,86.1 | v87.1,86 91.4,81.7 v93.7,79.8
  Bottom 0.152: U$1.70 52.99,97.21 v59.9,90.1 | v74.1,86.1 86.6,86.1 v87.1,86 | v93.7,79.8 98.3,79.8 101.3,82.5 101.3,83.6 118.3,100.6 122.4,100.6 130.7,108.9 130.7,134.7 122.6,142.8 47.3,142.8 45.3,140.8 45.3,137.65 Q7.4
PWM12  (via drill 0.33)
  Top 0.152: v61.8,88.4 66,85.5 72.4,85.5 v73.3,84.5 | v85.3,84.2 89.8,80.1 v91.7,78.8
  Bottom 0.152: U$1.65 48.49,103.7 49.2,103 49.2,98.8 59.4,88.4 v61.8,88.4 | v73.3,84.5 73.5,84.3 84.8,84.3 v85.3,84.2 | v91.7,78.8 91.7,78.6 92.1,78.3 98.4,78.3 102.5,82.2 102.5,83.2 118.7,99.4 122.7,99.4 131.9,108.6 131.9,135 122.9,144 33,144 30.5,141.5 30.5,137.63 Q8.2
PWM13  (via drill 0.33)
  Top 0.152: v62.7,88.6 63.6,88.1 66.4,85.9 72.7,85.9 v74.1,84.9 | v85.9,84.8 90.5,80.7 v92.6,78.9
  Bottom 0.152: U$1.68 50.45,98.05 59.4,89 62.3,89 v62.7,88.6 | v74.1,84.9 85.4,84.9 v85.9,84.8 | Q8.4 33.2,137.79 33.2,141.3 35.5,143.6 122.8,143.6 131.5,134.9 131.5,108.7 122.6,99.8 118.5,99.8 102.1,83.4 102.1,82.3 98.5,78.9 98.3,78.7 93.1,78.7 92.9,78.9 v92.6,78.9
PWM14  (via drill 0.33)
  Top 0.152: v57.5,88.5 57.5,87.8 58.2,87.4 60.8,87.4 65,84.7 70.3,84.7 v73.3,83.1 | v84.1,83 87.9,79.5 v90.5,77.5
  Bottom 0.152: U$1.64 45.37,100.93 v57.5,88.5 | v73.3,83.1 84,83.1 v84.1,83 | v90.5,77.5 98.9,77.5 103.3,81.9 103.3,83 118.9,98.6 122.9,98.6 132.7,108.4 132.7,135.2 123.1,144.8 24,144.8 21.3,142.1 21.3,137.66 Q9.2
PWM15  (via drill 0.33)
  Top 0.152: v58.7,88.2 60.6,88.2 65.7,85.1 71.9,85.1 73.1,83.7 v74,83.7 | v84.7,83.6 89,79.9 v91.2,78.1
  Bottom 0.152: U$1.66 47.91,99.29 v58.7,88.2 | v74,83.7 84.2,83.7 v84.7,83.6 | v91.2,78.1 91.4,77.9 98.6,77.9 102.9,82.1 102.9,83.1 118.8,99 122.8,99 132.3,108.5 132.3,135.1 123,144.4 27.5,144.4 23.9,140.8 Q9.4
PWM16
  Bottom 0.152: Q1.2 17.64,3.77 20.5,0.9 120,0.9 126.9,7.8 126.9,10.7 129.9,13.7 129.9,32.9 118,44.8 101.8,44.8 84.9,61.7 69.4,61.7 64.4,56.7 64.4,54.16 U$1.32
PWM17
  Bottom 0.152: Q1.4 15.1,5.71 20.3,0.5 120.2,0.5 127.3,7.6 127.3,10.5 130.3,13.5 130.3,33 118.1,45.2 102,45.2 85.1,62.1 68.6,62.1 63.1,56.6 63.1,55.49 U$1.31
PWM18
  Bottom 0.152: Q10.2 31.23,2.67 32.2,1.7 119.7,1.7 126.1,8.1 126.1,11 129.1,14 129.1,32.7 117.8,44 101.5,44 84.6,60.9 71.3,60.9 66.9,56.5 66.9,54.12 U$1.34
PWM19
  Bottom 0.152: Q10.4 28.7,3.31 30.7,1.3 119.8,1.3 126.5,8 126.5,10.9 129.5,13.9 129.5,32.8 117.9,44.4 101.6,44.4 84.7,61.3 70.5,61.3 65.7,56.5 U$1.33
PWM20
  Bottom 0.152: Q11.2 44.73,3.87 46.1,2.5 119.5,2.5 125.3,8.3 125.3,11.2 128.3,14.2 128.3,32.5 117.6,43.2 101.3,43.2 84.4,60.1 73.2,60.1 69.5,56.4 69.5,54.17 U$1.36
PWM21
  Bottom 0.152: Q11.4 42.2,4.41 44.5,2.1 119.6,2.1 125.7,8.2 125.7,11.1 128.7,14.1 128.7,32.6 117.7,43.6 101.4,43.6 84.5,60.5 72.1,60.5 68.2,56.6 68.2,55.48 U$1.35
PWM22
  Bottom 0.152: Q12.2 72.33,4.67 72.9,4.1 117.3,4.1 118.9,5.7 118.9,6.7 119.4,7.2 122.2,7.2 123.7,8.7 123.7,11.6 126.7,14.6 126.7,32.1 117.2,41.6 100.9,41.6 84,58.5 76.2,58.5 74.6,56.9 74.6,54.2 U$1.40
PWM23
  Bottom 0.152: Q12.4 69.8,6.41 72.5,3.7 117.5,3.7 119.3,5.5 119.3,6.5 119.6,6.8 122.3,6.8 124.1,8.6 124.1,11.5 127.1,14.5 127.1,32.2 117.3,42 101,42 84.1,58.9 75.4,58.9 73.3,56.8 U$1.39
PWM24
  Bottom 0.152: Q13.2 58.84,4.76 60.3,3.3 119.3,3.3 124.5,8.5 124.5,11.4 127.5,14.4 127.5,32.3 117.4,42.4 101.1,42.4 84.2,59.3 74.5,59.3 72.1,56.9 72.1,54.23 U$1.38
PWM25
  Bottom 0.152: Q13.4 56.3,6.61 60,2.9 119.4,2.9 124.9,8.4 124.9,11.3 127.9,14.3 127.9,32.4 117.5,42.8 101.2,42.8 84.3,59.7 74,59.7 70.8,56.5 70.8,55.48 U$1.37
PWM26
  Bottom 0.152: Q14.2 86.23,5.87 87.2,4.9 116.9,4.9 118.1,6.1 118.1,7 119.1,8 121.8,8 122.9,9.1 122.9,11.8 125.9,14.8 125.9,31.9 117,40.8 100.7,40.8 83.8,57.7 78.6,57.7 77.1,56.2 77.1,54.16 U$1.42
PWM27
  Bottom 0.152: Q14.4 83.69,6.8 86,4.5 117.1,4.5 118.5,5.9 118.5,6.8 119.3,7.6 122,7.6 123.3,8.9 123.3,11.7 126.3,14.7 126.3,32 117.1,41.2 100.8,41.2 83.9,58.1 78.5,58.1 U$1.41
PWM28
  Bottom 0.152: Q15.2 100.64,6.17 101.1,5.7 116.6,5.7 117.3,6.4 117.3,10.3 118,11.1 121,11.1 125.1,15.1 125.1,31.7 116.8,40 100.4,40 83.5,56.9 80.3,56.9 79.8,56.4 79.8,54.31 U$1.44
PWM29
  Bottom 0.152: Q15.4 98.09,5.71 98.5,5.3 116.7,5.3 117.7,6.3 117.7,10.2 118.1,10.7 121.1,10.7 125.5,15 125.5,31.8 116.9,40.4 100.5,40.4 83.6,57.3 80.25,57.3 U$1.43
PWM30
  Bottom 0.152: Q16.2 113.83,6.76 114.1,6.5 115.9,6.5 116.5,7.1 116.5,10.6 117.7,11.9 120.7,11.9 124.3,15.4 124.3,31.4 116.5,39.2 100,39.2 86.3,52.9 U$1.46
PWM31
  Bottom 0.152: Q16.4 111.3,6.8 111.9,6.1 116.1,6.1 116.9,6.9 116.9,10.5 117.8,11.5 120.8,11.5 124.7,15.3 124.7,31.5 116.6,39.6 100.2,39.6 84.3,55.5 80.98,55.5 U$1.45
RST  (via drill 0.33)
  Top 0.152: v38,25.5 v40.4,25.6 | v23.5,32 v25.1,32 | v45.5,122.5 v48.2,122.5 | J2.LH5 arc90 15.67,126.2 19.1,126.2 arc-90 v19.5,125.8 | v19,122.6 v20.3,124.1 | v23.1,126.7 24.5,126.2 arc73 J2.LG5 | v38.7,128.8 40.1,128.8 arc-62 J2.LF5 | v71.7,129.8 J2.LD5 | v82.7,129.8 J2.LC5 | J2.LB5 v95.2,131.5 | v98,123.6 98.4,123.6 arc-67 99.3,123 arc-51 99.1,119.1 arc133 J2.UB5 | J2.LA5 112.2,128.6 arc69 v108.6,133.3 | J3.UB5 v26.9,32 | v41.2,24.4 v42.4,25.8 | v50.5,18.6 56.1,18.6 arc104 J3.LD5 | J3.UE5 arc80 70.1,28 arc-75 69.7,24.9 v69.1,24.3 arc98 67.2,24.5 arc7 65.3,22.5 v64.8,21.9 | J3.UG5 v99.8,31.1 | v97.6,38.9 97.6,32.5 v97.5,32.4